# EasyEDA Pro project ProProject_基于STM32的Buck-Boost型数字电源_2024-06-04.epro, board PCB2
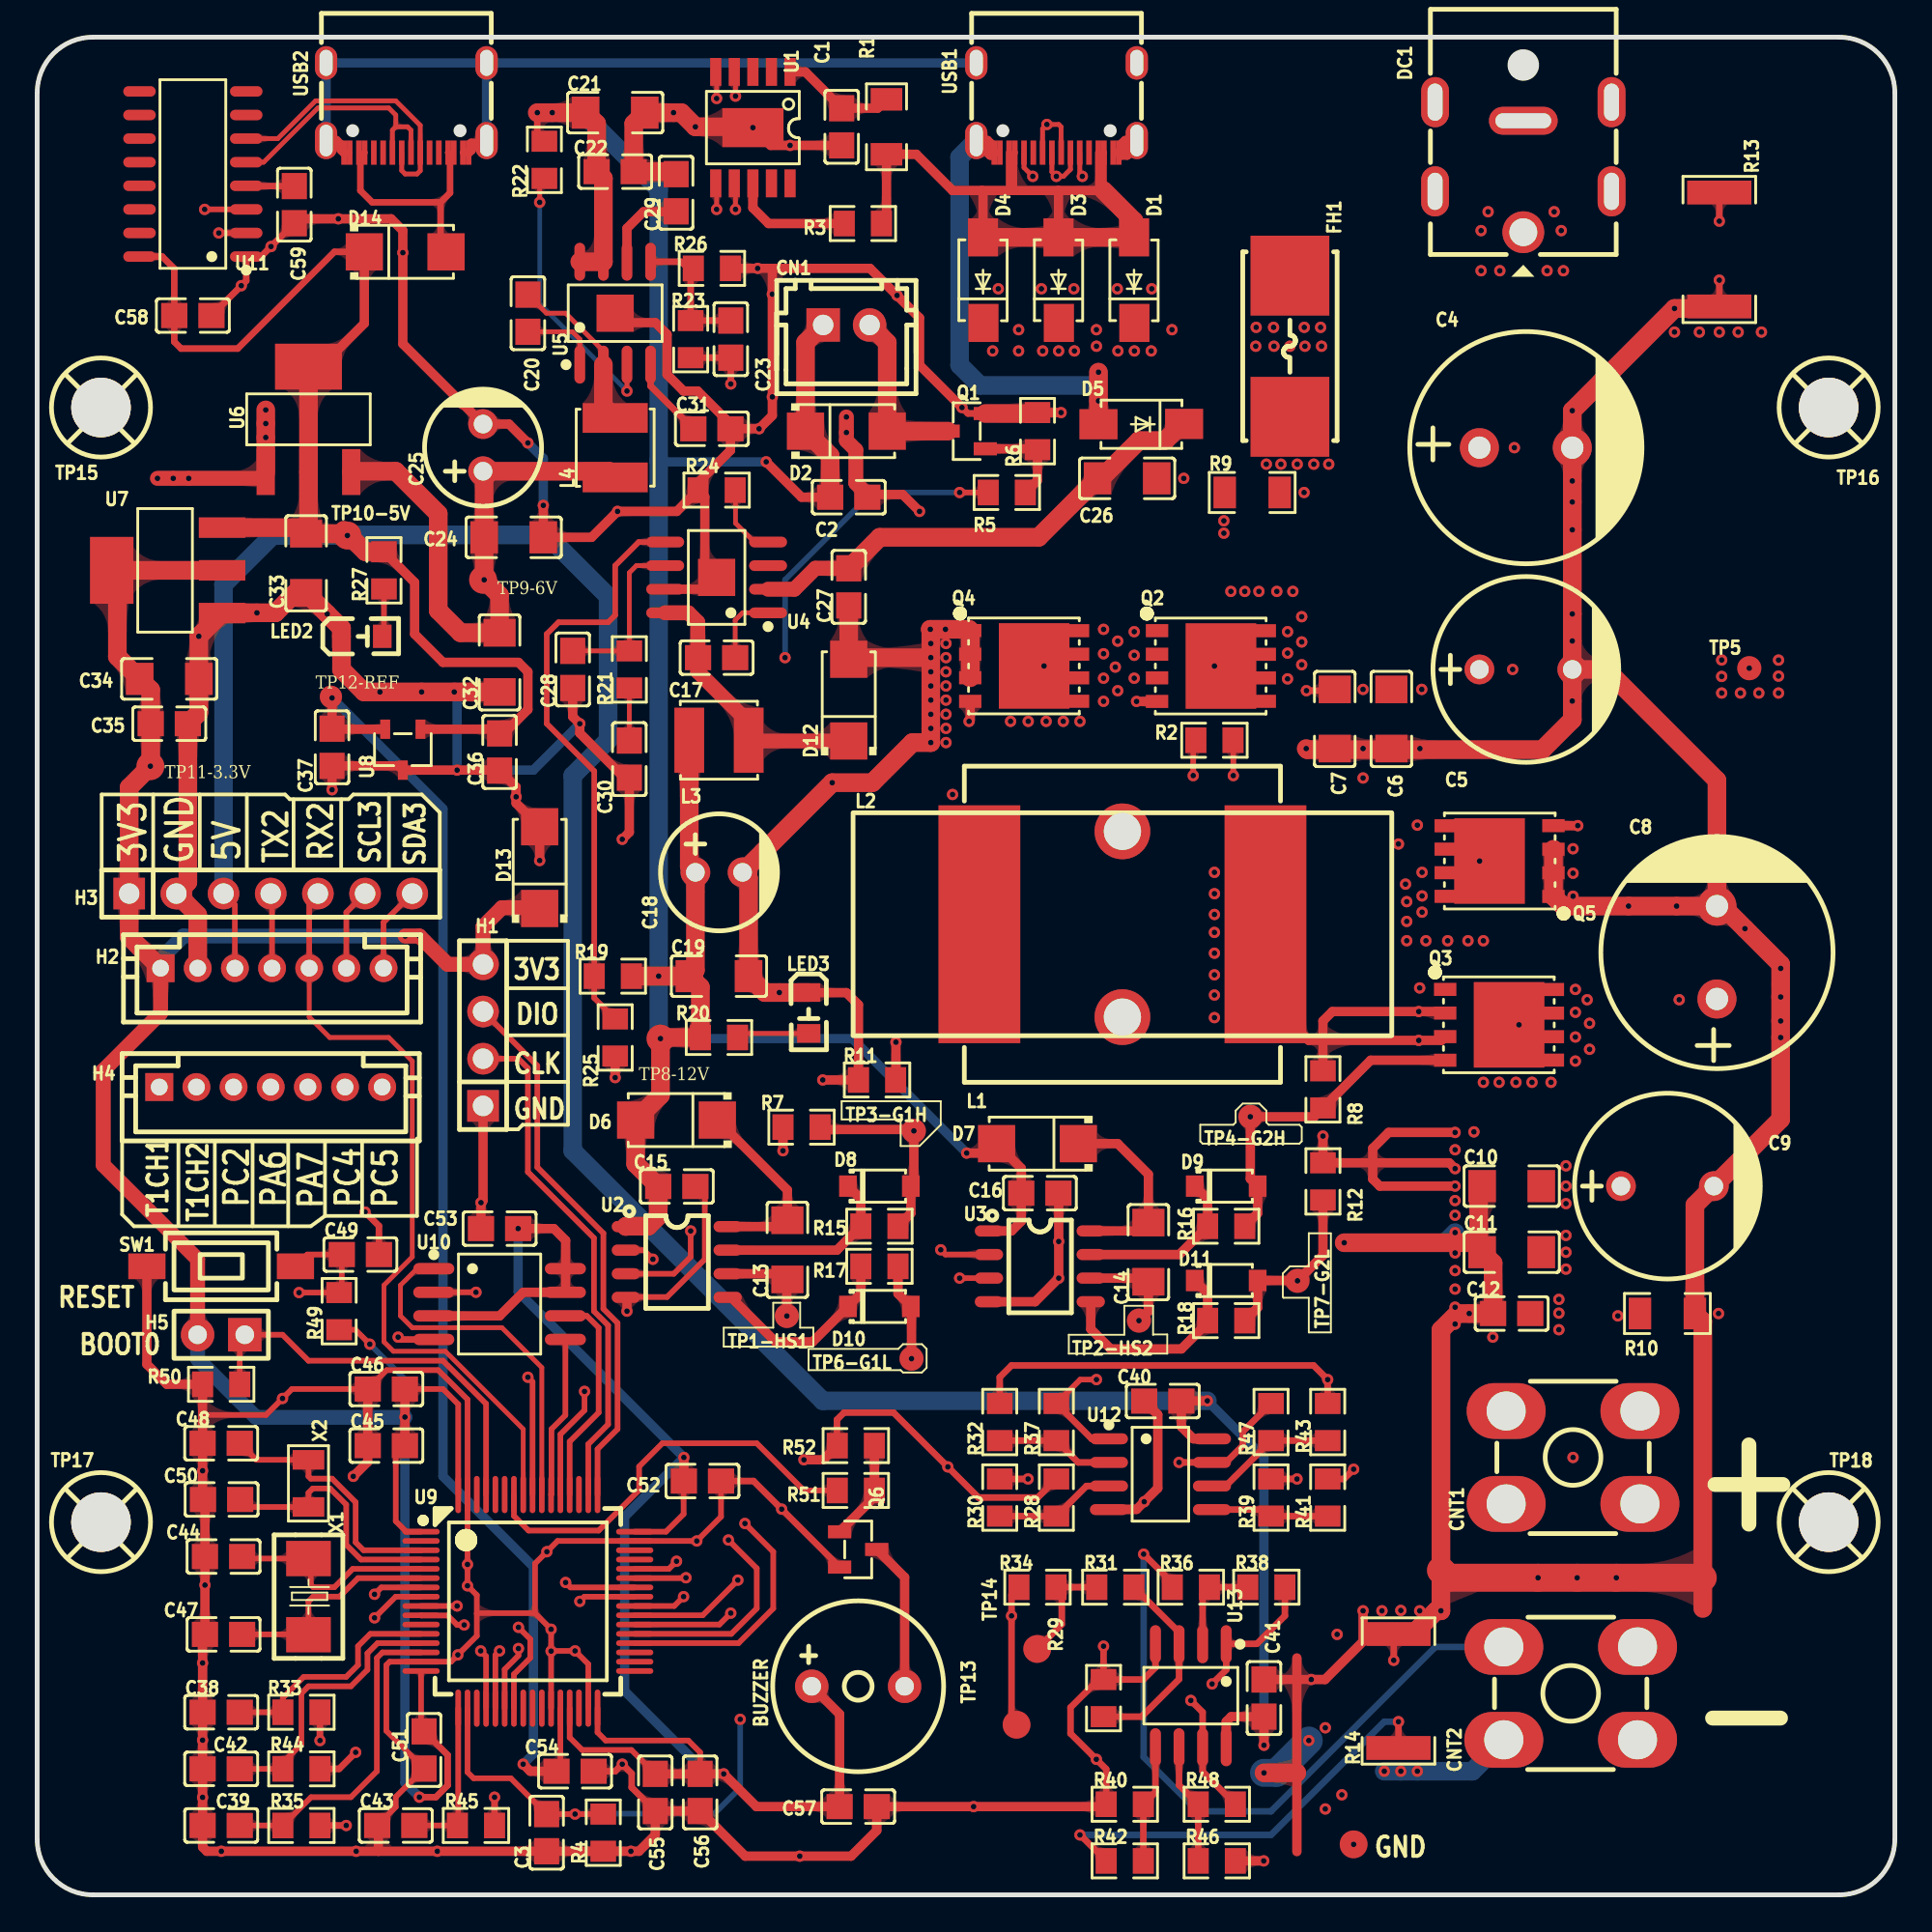
[diagram p9: board, top side]
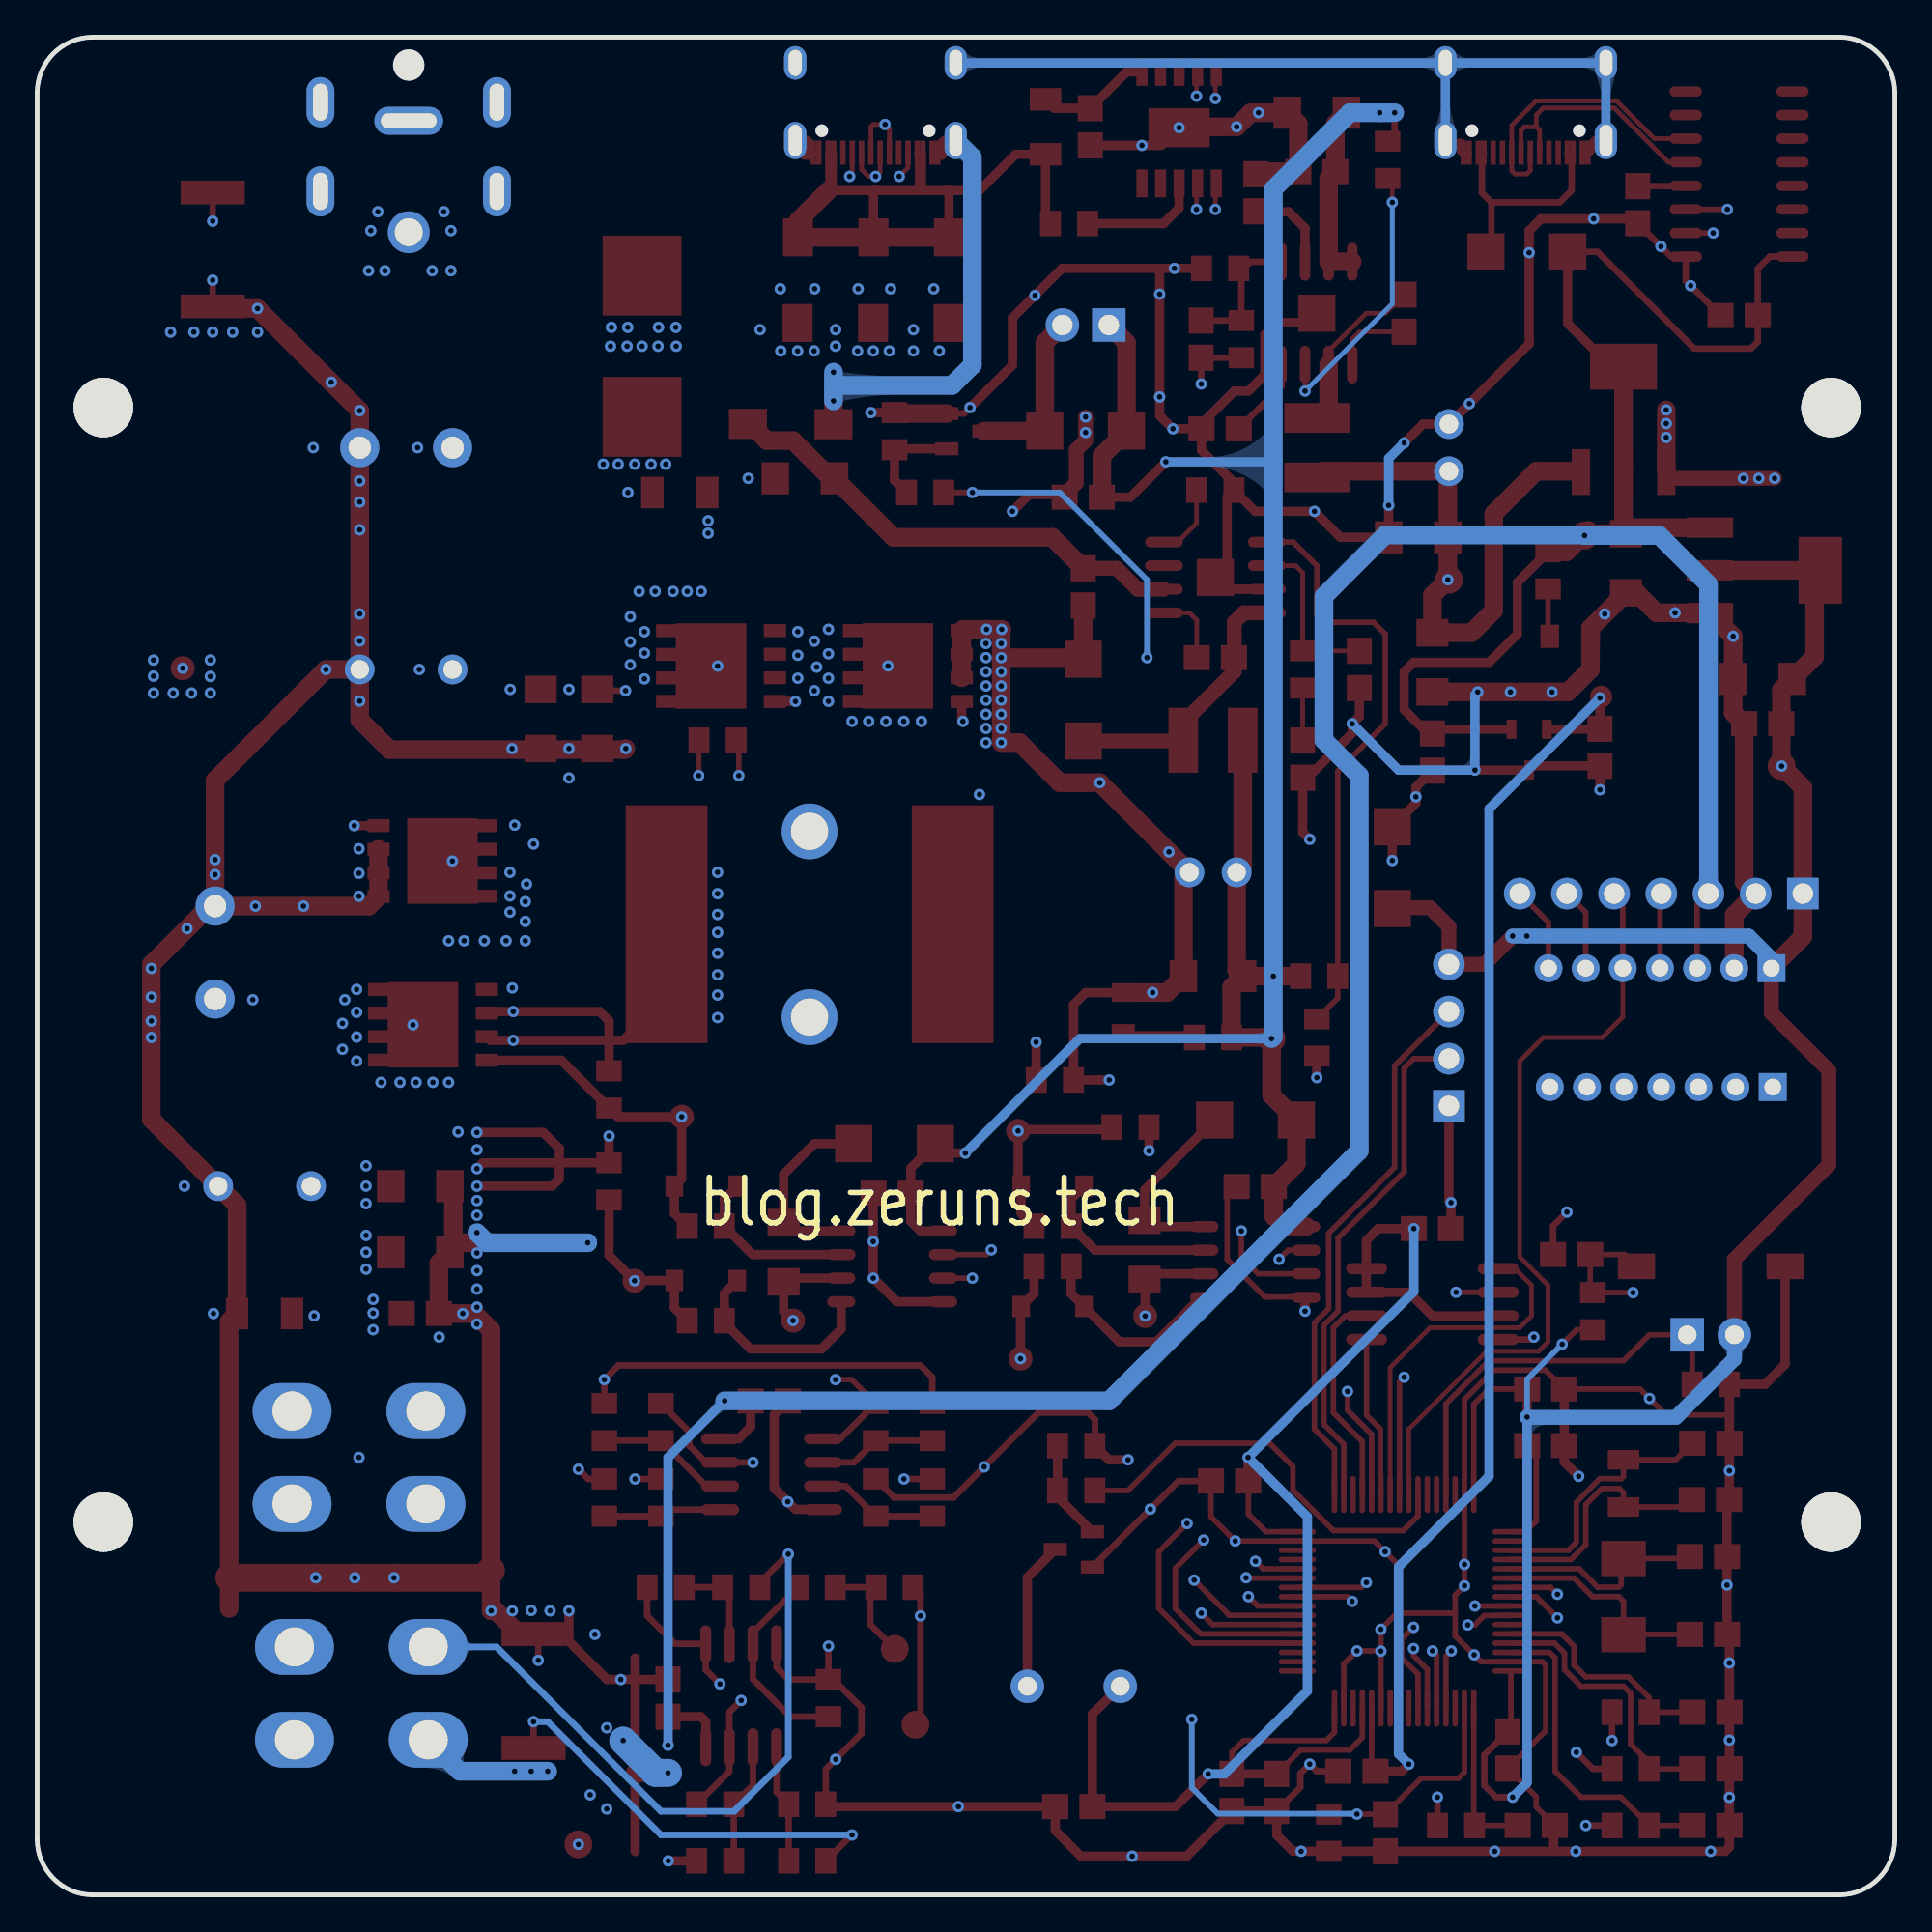
[diagram p10: board, bottom side, seen from below]

Outline 100 x 100 mm; copper layers: Top Layer, GND层, Inner2, Bottom Layer. Coordinates in mm from the lower left corner of the outline.
Outline path: 0,97 0,3 arc(0.88,0.88) 3,0 97,0 arc(99.12,0.88) 100,3 100,97 arc(99.12,99.12) 97,100 3,100 arc(0.88,99.12) 0,97
Stack: Top Layer 0.035mm 外层铜厚1oz / Dielectric1 0.2104mm 7628 RC49% 8.6mil / GND层 0.0152mm 内层铜厚 / Dielectric2 1.065mm 1.1mm H/HOZ 含铜 / Inner2 0.0152mm 内层铜厚 / Dielectric3 0.2104mm 7628 RC49% 8.6mil / Bottom Layer 0.035mm 外层铜厚1oz

## Design rules (mm)
template: 自定义配置
spacing copperThickness1oz (default): track to track 0.102, other pairs 0.152 to 0.3
spacing copperThickness2oz: track to track 0.203, other pairs 0.152 to 0.3
track width copperThickness1oz (default): min 0.127, default 0.254, max 2.54
track width copperThickness2oz: min 0.203, default 0.254, max 2.54
differential pair differentialPair (default): width min 0.127, default 0.254, max 2.54; gap min 0.152, default 0.152
via viaSize (default): diameter min 0.5, default 0.61, max 10; hole min 0.3, default 0.305, max 6.3
net VIN- uses 直连
net VBUS uses 直连
net $1N2183 uses 直连
net GND uses innerPlane1, 直连
net VIN+ uses 直连
net HS-1 uses 直连
net HS-2 uses 直连
net VOUT+ uses 直连
net VOUT- uses 直连
pour e2531 uses copperRegion
pour e2479 uses copperRegion
pour e2565 uses copperRegion
pour e2384 uses copperRegion
pour e2269 uses copperRegion
pour e2353 uses copperRegion
pour e2671 uses copperRegion
pour e2172 uses copperRegion

## Placement (name value [footprint] x y rotation side)
BUZZER  2.9kHz  [BUZ-TH_BD9.0-P5.00-D0.6-FD]  44.2 11.23 0 top
C1  1μF  [C0805]  43.31 95.17 90 top
C2  1μF  [C0805]  43.69 75.23 180 top
C3  100nF  [C0805]  27.43 3.35 90 top
C4  470uF  [CAP-TH_BD12.5-P5.00-D0.6-FD]  80.14 77.9 0 top
C5  220uF  [CAP-TH_BD10.0-P5.00-D0.6-FD-A]  80.14 65.96 0 top
C6  10uF  [C1206]  72.9 63.3 90 top
C7  10uF  [C1206]  69.85 63.3 90 top
C8  470uF  [CAP-TH_BD12.5-P5.00-D0.6-FD]  90.42 50.72 90 top
C9  220uF  [CAP-TH_BD10.0-P5.00-D0.6-FD-A]  87.76 38.15 0 top
C10  10uF  [C1206]  79.38 38.15 0 top
C11  10uF  [C1206]  79.38 34.59 0 top
C12  470nF  [C0805]  79.38 31.29 0 top
C13  1uF  [C1206]  40.39 34.72 90 top
C14  1uF  [C1206]  59.82 34.59 90 top
C15  470nF  [C0805]  34.43 38.13 180 top
C16  470nF  [C0805]  53.97 37.77 180 top
C17  100nF  [C0805]  36.58 66.6 180 top
C18  330uF  [CAP-TH_BD6.3-P2.50-D1.0-FD]  36.7 55.04 0 top
C19  10uF  [C1206]  36.7 49.45 180 top
C20  100nF  [C0805]  26.42 85.14 90 top
C21  10uF  [C1206]  31.12 95.94 180 top
C22  1uF  [C0805]  31.12 92.76 180 top
C23  100pF  [C0805]  37.34 83.74 270 top
C24  10uF  [C1206]  25.65 73.08 180 top
C25  330uF  [CAP-TH_BD6.3-P2.50-D1.0-FD]  24 77.9 90 top
C26  10uF  [C1206]  58.67 76.25 180 top
C27  470nF  [C0805]  43.69 70.41 90 top
C28  39pF  [C0805]  28.83 65.96 270 top
C29  1uF  [C0805]  34.4 91.62 270 top
C30  6.8nF  [C0805]  31.88 61.14 270 top
C31  1uF  [C0805]  36.32 78.92 180 top
C32  10uF  [C1206]  24.89 66.34 90 top
C33  10uF  [C1206]  14.48 71.68 90 top
C34  10uF  [C1206]  7.11 65.46 180 top
C35  470nF  [C0805]  7.11 63.04 180 top
C36  470nF  [C0805]  24.89 61.52 90 top
C37  470nF  [C0805]  15.88 61.77 90 top
C38  330pF  [C0805]  9.91 9.83 0 top
C39  330pF  [C0805]  9.91 3.73 0 top
C40  470nF  [C0805]  60.59 26.58 180 top
C41  470nF  [C0805]  66.04 10.59 90 top
C42  330pF  [C0805]  9.91 6.78 0 top
C43  330pF  [C0805]  19.3 3.73 0 top
C44  20pF  [C0805]  10.03 18.21 0 top
C45  100nF  [C0805]  18.8 24.18 0 top
C46  470nF  [C0805]  18.8 27.23 180 top
C47  20pF  [C0805]  10.03 14.02 0 top
C48  12pF  [C0805]  9.91 24.31 0 top
C49  100nF  [C0805]  17.4 34.47 180 top
C50  12pF  [C0805]  9.93 21.28 0 top
C51  470nF  [C0805]  20.83 7.8 270 top
C52  470nF  [C0805]  35.81 22.28 0 top
C53  470nF  [C0805]  24.89 35.86 0 top
C54  470nF  [C0805]  28.96 6.66 180 top
C55  1uF  [C0805]  33.27 5.51 90 top
C56  470nF  [C0805]  35.69 5.51 90 top
C57  470nF  [C0805]  44.2 4.75 0 top
C58  470nF  [C0805]  8.38 85.01 180 top
C59  100nF  [C0805]  13.84 90.98 90 top
CN1  ZX-XH2.54-2PZZ  [CONN-TH_2P-P2.50_HX25003-2A]  43.56 84.51 0 top
CNT1  T34001  [CONN-TH_T34001]  82.68 23.55 90 top
CNT2  T34001  [CONN-TH_T34001]  82.55 10.85 90 top
D1  SS56  [SMA_L4.3-W2.6-LS5.0-FD]  59.06 86.92 270 top
D2  SS310  [SMA_L4.3-W2.6-LS5.2-RD]  43.56 78.79 0 top
D3  SS56  [SMA_L4.3-W2.6-LS5.0-FD]  54.99 86.92 270 top
D4  SS56  [SMA_L4.3-W2.6-LS5.0-FD]  50.93 86.92 270 top
D5  SS56  [SMA_L4.3-W2.6-LS5.0-FD]  59.44 79.17 0 top
D6  SS310  [SMA_L4.3-W2.6-LS5.2-RD]  34.42 41.71 180 top
D7  SS310  [SMA_L4.3-W2.6-LS5.2-RD]  53.85 40.44 180 top
D8  1N4148W  [SOD-123_L2.8-W1.8-LS3.7-RD]  45.34 38.15 0 top
D9  1N4148W  [SOD-123_L2.8-W1.8-LS3.7-RD]  64.01 38.15 0 top
D10  1N4148W  [SOD-123_L2.8-W1.8-LS3.7-RD]  45.34 31.67 0 top
D11  1N4148W  [SOD-123_L2.8-W1.8-LS3.7-RD]  64.01 33.07 0 top
D12  SS310  [SMA_L4.3-W2.6-LS5.2-RD]  43.69 64.31 90 top
D13  SS310  [SMA_L4.3-W2.6-LS5.2-RD]  27.05 55.3 90 top
D14  SS310  [SMA_L4.3-W2.6-LS5.2-RD]  19.81 88.44 0 top
DC1  HC-DC-007B-2.0  [DC-IN-TH_HC-DC-007B-2.0]  80 93 0 top
FH1  01550900M  [FUSE-SMD_L9.8-W5.0]  67.44 83.36 270 top
H1  -  [HDR-TH_4P-P2.54-V-M]  24 46.28 90 top
H2  BX-PH2.0-7PZZ  [CONN-TH_7P-P2.00_BX-PH2.0-7PZZ]  12.64 49.88 0 top
H3  -  [HDR-TH_7P-P2.54-V-M]  12.57 53.9 0 top
H4  BX-PH2.0-7PZZ  [CONN-TH_7P-P2.00_BX-PH2.0-7PZZ]  12.57 43.48 0 top
H5  -  [HDR-TH_2P-P2.54-V-M-1]  9.91 30.15 180 top
L1  22uH  [IND-SMD_L17.0-W17.0_YSPIA1770-100M]  58.42 52.25 0 top
L2  22uH  [ind-th_l29.0-w12.0-p10.00]  58.42 52.25 270 top
L3  10uH  [IND-SMD_L4.0-W4.0]  36.7 62.15 180 top
L4  10uH  [IND-SMD_L4.0-W4.0]  31.12 77.9 270 top
LED2  NCD0805R1  [LED_0805]  17.53 67.74 0 top
LED3  -  [LED_0805]  41.53 47.42 270 top
NOREF  -  [Pad_e29531]  70.87 2.72 0 top
Q1  -  [SOT-23-3_L2.9-W1.3-P1.90-LS2.4-BR]  50.04 78.79 0 top
Q2  CJAC80SN10  [PDFN-8_L5.8-W5.0-P1.27-LS6.0-BL]  63.18 66.15 270 top
Q3  CJAC80SN10  [PDFN-8_L5.8-W5.0-P1.27-LS6.0-BL]  78.69 46.83 270 top
Q4  CJAC80SN10  [PDFN-8_L5.8-W5.0-P1.27-LS6.0-BL]  53.13 66.15 270 top
Q5  CJAC80SN10  [PDFN-8_L5.8-W5.0-P1.27-LS6.0-BL]  78.72 55.65 90 top
Q6  -  [SOT-23-3_L2.9-W1.3-P1.90-LS2.4-BR]  44.2 18.59 180 top
R1  1K  [R1206]  45.72 95.17 270 top
R2  SDNT2012X103F3950FTF  [R0805]  63.37 62.15 0 top
R3  10K  [R0805]  44.45 89.97 0 top
R4  10kΩ  [R0805]  30.47 3.35 90 top
R5  10Ω  [R0805]  52.2 75.49 180 top
R6  10kΩ  [R0805]  53.85 78.79 270 top
R7  10kΩ  [R0805]  41.15 41.33 0 top
R8  10kΩ  [R0805]  69.22 43.36 270 top
R9  10kΩ  [R1206]  65.41 75.49 0 top
R10  10kΩ  [R1206]  87.76 31.29 180 top
R11  10kΩ  [R0805]  45.21 43.87 0 top
R12  10kΩ  [R0805]  69.22 38.41 270 top
R13  5mΩ  [R2512]  90.55 88.57 270 top
R14  5mΩ  [R2512]  73.28 10.97 270 top
R15  10Ω  [R0805]  45.34 35.99 180 top
R16  10Ω  [R0805]  64.01 35.99 180 top
R17  10Ω  [R0805]  45.34 33.83 180 top
R18  10Ω  [R0805]  64.01 30.91 180 top
R19  68K  [R0805]  30.99 49.45 0 top
R20  4.7K  [R0805]  36.7 46.15 180 top
R21  10K  [R0805]  31.88 65.96 90 top
R22  10kΩ  [R0805]  27.31 93.4 270 top
R23  9.1K  [R0805]  35.18 83.74 270 top
R24  110K  [R0805]  36.58 75.62 0 top
R25  4.7K  [R0805]  31.12 46.15 90 top
R26  1kΩ  [R0805]  36.32 87.55 180 top
R27  1kΩ  [R0805]  18.67 71.3 270 top
R28  4.7kΩ  [R0805]  54.86 21.39 90 top
R29  4.7kΩ  [R0805]  57.4 10.59 90 top
R30  75kΩ  [R0805]  51.82 21.39 270 top
R31  75kΩ  [R0805]  58.04 16.56 0 top
R32  75kΩ  [R0805]  51.82 25.45 270 top
R33  100Ω  [R0805]  14.22 9.83 0 top
R34  5Ω  [R0805]  53.85 16.56 0 top
R35  100Ω  [R0805]  14.22 3.73 0 top
R36  75kΩ  [R0805]  62.1 16.56 0 top
R37  4.7kΩ  [R0805]  54.86 25.45 270 top
R38  4.7kΩ  [R0805]  66.17 16.56 180 top
R39  6.2kΩ  [R0805]  66.42 21.39 90 top
R40  6.2kΩ  [R0805]  58.55 4.88 180 top
R41  100Ω  [R0805]  69.47 21.39 270 top
R42  100Ω  [R0805]  58.55 1.83 0 top
R43  100Ω  [R0805]  69.47 25.45 270 top
R44  100Ω  [R0805]  14.22 6.78 0 top
R45  100Ω  [R0805]  23.62 3.73 0 top
R46  100Ω  [R0805]  63.5 1.83 180 top
R47  6.2kΩ  [R0805]  66.42 25.45 270 top
R48  6.2kΩ  [R0805]  63.5 4.88 180 top
R49  10kΩ  [R0805]  16.26 31.42 270 top
R50  10kΩ  [R0805]  9.91 27.48 0 top
R51  10Ω  [R0805]  44.07 21.77 180 top
R52  10kΩ  [R0805]  44.07 24.18 0 top
SW1  TSA363G25-250B  [SW-SMD_L6.1-W3.6-LS8.0]  9.91 33.83 0 top
TP1-HS1  -  [test-point-0.5mm]  40.36 31.16 0 top
TP2-HS2  -  [test-point-0.5mm]  59.31 30.91 0 top
TP3-G1H  -  [test-point-0.5mm]  47.19 41.12 0 top
TP4-G2H  -  [test-point-0.5mm]  65.31 41.89 0 top
TP5  -  [test-point-0.5mm]  92.16 66.03 0 top
TP6-G1L  -  [test-point-0.5mm]  47.07 28.86 0 top
TP7-G2L  -  [test-point-0.5mm]  67.84 33.05 0 top
TP8-12V  -  [test-point-0.5mm#2]  33.55 46.09 0 top
TP9-6V  -  [test-point-0.5mm#2]  24 70.79 0 top
TP10-5V  -  [test-point-0.5mm#2]  16.7 73.17 0 top
TP11-3.3V  -  [test-point-0.5mm#2]  6.1 60.76 0 top
TP12-REF  -  [test-point-0.5mm#3]  15.81 64.49 0 top
TP13  -  [test-point-0.5mm#2]  52.72 9.16 0 top
TP14  -  [test-point-0.5mm#2]  53.83 13.24 0 top
TP15  -  [M3螺丝]  3.5 80 0 top
TP16  -  [M3螺丝]  96.5 80 0 top
TP17  -  [M3螺丝]  3.5 20 0 top
TP18  -  [M3螺丝]  96.5 20 0 top
U1  CH224K  [ESSOP-10_L4.9-W3.9-P1.0-LS6.0-TL-EP]  38.53 95.13 180 top
U2  EG3112  [SOP-8_L5.0-W3.9-P1.27-LS6.0-BL]  34.43 34.07 270 top
U3  EG3112  [SOP-8_L5.0-W3.9-P1.27-LS6.0-BL]  53.97 33.83 270 top
U4  TPS54360BDDAR  [SOIC-8_L5.0-W4.0-P1.27-LS6.0-BL-EP2.0]  36.58 70.92 90 top
U5  SY8205FCC  [SOIC-8_L5.0-W4.0-P1.27-LS6.0-BL-EP2.0]  31.12 85.14 0 top
U6  AMS1117-5.0  [SOT-223-4_L6.5-W3.5-P2.30-LS7.0-BR]  14.61 79.43 270 top
U7  AMS1117-3.3  [SOT-223-3_L6.5-W3.5-P3.05-LS7.0]  6.98 71.3 0 top
U8  REF3033AIDBZR  [SOT-23-3_L3.0-W1.7-P0.95-LS2.9-BR]  19.69 61.65 90 top
U9  STM32G474RET6  [LQFP-64_L10.0-W10.0-P0.50-LS12.0-BL]  26.42 15.8 270 top
U10  W25Q64JVSSIQ  [SOP-8_L5.3-W5.3-P1.27-LS8.0-BL]  24.89 31.8 270 top
U11  CH340C  [SOP-16_L10.0-W3.9-P1.27-LS6.0-BL]  8.38 92.63 90 top
U12  GS8558-SR  [SOIC-8_L4.9-W3.8-P1.27-LS6.0-BL]  60.47 22.64 270 top
U13  GS8558-SR  [SOIC-8_L4.9-W3.8-P1.27-LS6.0-BL]  62.1 10.72 180 top
USB1  -  [USB_TYPE-C-16P]  55 96.2 180 top
USB2  -  [USB_TYPE-C-16P]  20 96.2 180 top
X1  25MHz  [OSC-SMD_L5.0-W3.2]  14.61 16.05 90 top
X2  32.768kHz  [CRYSTAL-SMD_L3.2-W1.5-2]  14.61 22.15 90 top

## Footprints (pads in the part's own frame, mm; a bottom-side part is the same pattern mirrored in y, then rotated)
BUZ-TH_BD9.0-P5.00-D0.6-FD
  round 1.8 hole 1: 1(-2.5,0) 2(2.5,0)
C0805
  rect 1.41x1.35 smd: 1(-1,0) 2(1,0)
C1206
  rect 1.485x1.728 smd: 1(-1.593,0) 2(1.593,0)
CAP-TH_BD6.3-P2.50-D1.0-FD
  round 1.6 hole 1: 1(-1.27,0) 2(1.27,0)
CAP-TH_BD10.0-P5.00-D0.6-FD-A
  round 1.6 hole 1: 1(-2.5,0) 2(2.5,0)
CAP-TH_BD12.5-P5.00-D0.6-FD
  round 2.1 hole 1.2: 1(-2.5,0) 2(2.5,0)
CONN-TH_2P-P2.50_HX25003-2A
  rect 1.8x1.8 hole 1.1: 1(-1.25,0)
  round 1.8 hole 1.1: 2(1.25,0)
CONN-TH_7P-P2.00_BX-PH2.0-7PZZ
  rect 1.5x1.5 hole 0.9: 1(-6,0)
  round 1.5 hole 0.9: 2(-4,0) 3(-2,0) 4(0,0) 5(2,0) 6(4,0) 7(6,0)
CONN-TH_T34001
  oval 3x4.25 hole 2.1: 1(-2.5,-3.6) 2(2.5,-3.6) 3(2.5,3.6) 4(-2.5,3.6)
CRYSTAL-SMD_L3.2-W1.5-2
  rect 1.05x1.7 smd: 1(-1.27,0) 2(1.27,0)
DC-IN-TH_HC-DC-007B-2.0
  round 2.25 hole 1.5: 1(0,-3.5)
  oval 3.7x1.5 hole 2.999x0.8: 2(0,2.5)
  oval 1.5x2.7 hole 0.8x2: 3(-4.75,3.5) 3(-4.75,-1.3) 3(4.75,3.5) 3(4.75,-1.3)
ESSOP-10_L4.9-W3.9-P1.0-LS6.0-TL-EP
  rect 0.6x1.5 smd: 1(-2,-3) 2(-1,-3) 3(0,-3) 4(1,-3) 5(2,-3) 6(2,3) 7(1,3) 8(0,3) 9(-1,3) 10(-2,3)
  rect 3.3x2.1 smd: 11(0,0)
FUSE-SMD_L9.8-W5.0
  rect 4.3x4.24 smd: 1(-3.8,0) 2(3.8,0)
HDR-TH_2P-P2.54-V-M-1
  rect 1.8x1.8 hole 1: 1(-1.27,0)
  round 1.8 hole 1: 2(1.27,0)
HDR-TH_4P-P2.54-V-M
  rect 1.7x1.7 hole 1.1: 1(-3.81,0)
  round 1.7 hole 1.1: 2(-1.27,0) 3(1.27,0) 4(3.81,0)
HDR-TH_7P-P2.54-V-M
  rect 1.7x1.7 hole 1.1: 1(-7.62,0)
  round 1.7 hole 1.1: 2(-5.08,0) 3(-2.54,0) 4(0,0) 5(2.54,0) 6(5.08,0) 7(7.62,0)
IND-SMD_L4.0-W4.0
  rect 1.6x3.5 smd: 1(-1.6,0) 2(1.6,0)
IND-SMD_L17.0-W17.0_YSPIA1770-100M
  rect 4.4x12.8 smd: 1(-7.7,0) 2(7.7,0)
ind-th_l29.0-w12.0-p10.00
  round 3 hole 2: 1(-5,0) 2(5,0)
LED_0805
  rect 1x1.25 smd: 1(-1.15,0.005) 2(1.05,0.005)
LQFP-64_L10.0-W10.0-P0.50-LS12.0-BL
  oval 0.3x2 smd: 1(-3.75,-5.75) 2(-3.25,-5.75) 3(-2.75,-5.75) 4(-2.25,-5.75) 5(-1.75,-5.75) 6(-1.25,-5.75) 7(-0.75,-5.75) 8(-0.25,-5.75) 9(0.25,-5.75) 10(0.75,-5.75) 11(1.25,-5.75) 12(1.75,-5.75) 13(2.25,-5.75) 14(2.75,-5.75) 15(3.25,-5.75) 16(3.75,-5.75) 33(3.75,5.75) 34(3.25,5.75) 35(2.75,5.75) 36(2.25,5.75) 37(1.75,5.75) 38(1.25,5.75) 39(0.75,5.75) 40(0.25,5.75) 41(-0.25,5.75) 42(-0.75,5.75) 43(-1.25,5.75) 44(-1.75,5.75) 45(-2.25,5.75) 46(-2.75,5.75) 47(-3.25,5.75) 48(-3.75,5.75)
  oval 2x0.3 smd: 17(5.75,-3.75) 18(5.75,-3.25) 19(5.75,-2.75) 20(5.75,-2.25) 21(5.75,-1.75) 22(5.75,-1.25) 23(5.75,-0.75) 24(5.75,-0.25) 25(5.75,0.25) 26(5.75,0.75) 27(5.75,1.25) 28(5.75,1.75) 29(5.75,2.25) 30(5.75,2.75) 31(5.75,3.25) 32(5.75,3.75) 49(-5.75,3.75) 50(-5.75,3.25) 51(-5.75,2.75) 52(-5.75,2.25) 53(-5.75,1.75) 54(-5.75,1.25) 55(-5.75,0.75) 56(-5.75,0.25) 57(-5.75,-0.25) 58(-5.75,-0.75) 59(-5.75,-1.25) 60(-5.75,-1.75) 61(-5.75,-2.25) 62(-5.75,-2.75) 63(-5.75,-3.25) 64(-5.75,-3.75)
M3螺丝
  round 3.2 hole 3.2: 1(-0.064,0.064)
OSC-SMD_L5.0-W3.2
  rect 1.9x2.4 smd: 1(-2.05,0) 2(2.05,0)
Pad_e29531
  round 1.5 smd: TP1(0,0)
PDFN-8_L5.8-W5.0-P1.27-LS6.0-BL
  rect 0.7x1.2 smd: 1(-1.905,-2.9) 2(-0.635,-2.9) 3(0.635,-2.9) 4(1.905,-2.9) 5(1.9,2.9) 6(0.64,2.9) 7(-0.63,2.9) 8(-1.9,2.9)
  rect 4.6x3.8 smd: 9(0,0.54)
R0805
  rect 1.133x1.377 smd: 1(-1,0) 2(1,0)
R1206
  rect 1.208x1.701 smd: 1(-1.479,0) 2(1.479,0)
R2512
  rect 1.282x3.456 smd: 1(-3.067,0) 2(3.067,0)
SMA_L4.3-W2.6-LS5.0-FD
  rect 2.046x1.62 smd: 1(-2.304,-0.009) 2(2.304,0.009)
SMA_L4.3-W2.6-LS5.2-RD
  rect 2x2 smd: 1(-2.2,0) 2(2.2,0)
SOD-123_L2.8-W1.8-LS3.7-RD
  rect 0.95x1.15 smd: 1(-1.692,0) 2(1.692,0)
SOIC-8_L4.9-W3.8-P1.27-LS6.0-BL
  oval 0.588x2.045 smd: 1(-1.905,-2.772) 2(-0.635,-2.772) 3(0.635,-2.772) 4(1.905,-2.772) 5(1.905,2.772) 6(0.635,2.772) 7(-0.635,2.772) 8(-1.905,2.772)
SOIC-8_L5.0-W4.0-P1.27-LS6.0-BL-EP2.0
  oval 0.574x2.038 smd: 1(-1.905,-2.769) 2(-0.635,-2.769) 3(0.635,-2.769) 4(1.905,-2.769) 5(1.905,2.769) 6(0.635,2.769) 7(-0.635,2.769) 8(-1.905,2.769)
  rect 2x2 smd: 9(0,0)
SOP-8_L5.0-W3.9-P1.27-LS6.0-BL
  oval 0.6x1.52 smd: 1(-1.905,-2.74) 2(-0.635,-2.74) 3(0.635,-2.74) 4(1.905,-2.74) 5(1.905,2.74) 6(0.635,2.74) 7(-0.635,2.74) 8(-1.905,2.74)
SOP-8_L5.3-W5.3-P1.27-LS8.0-BL
  oval 0.609x2.204 smd: 1(-1.905,-3.542) 2(-0.635,-3.542) 3(0.635,-3.542) 4(1.905,-3.542) 5(1.905,3.542) 6(0.635,3.542) 7(-0.635,3.542) 8(-1.905,3.542)
SOP-16_L10.0-W3.9-P1.27-LS6.0-BL
  oval 0.56x1.745 smd: 1(-4.445,-2.873) 2(-3.175,-2.873) 3(-1.905,-2.873) 4(-0.635,-2.873) 5(0.635,-2.873) 6(1.905,-2.873) 7(3.175,-2.873) 8(4.445,-2.873) 9(4.445,2.873) 10(3.175,2.873) 11(1.905,2.873) 12(0.635,2.873) 13(-0.635,2.873) 14(-1.905,2.873) 15(-3.175,2.873) 16(-4.445,2.873)
SOT-23-3_L2.9-W1.3-P1.90-LS2.4-BR
  rect 1.25x0.7 smd: 1(1,-0.95) 2(1,0.95) 3(-1,0)
SOT-23-3_L3.0-W1.7-P0.95-LS2.9-BR
  rect 1.038x0.532 smd: 1(1.101,-0.95) 2(1.101,0.95) 3(-1.101,0)
SOT-223-3_L6.5-W3.5-P3.05-LS7.0
  rect 2.5x1.1 smd: 1(2.97,-2.3) 2(2.97,0) 3(2.97,2.3)
  rect 2.34x3.6 smd: 4(-2.97,0)
SOT-223-4_L6.5-W3.5-P2.30-LS7.0-BR
  rect 2.47x0.98 smd: 1(2.835,-2.3) 2(2.835,0) 3(2.835,2.3)
  rect 2.47x3.6 smd: 4(-2.835,0)
SW-SMD_L6.1-W3.6-LS8.0
  rect 2x1.38 smd: 1(-4,0) 2(4,0)
test-point-0.5mm
  round 1.3 smd: 1(0,0)
test-point-0.5mm#2
  round 1.5 smd: 1(0,0)
test-point-0.5mm#3
  round 1.2 smd: 1(0,0)
USB_TYPE-C-16P
  oval 1.2x2 hole 0.7x1.7: 1(-4.193,1.765) 2(4.447,1.765)
  oval 1.2x1.8 hole 0.7x1.4: 3(-4.193,-2.415) 4(4.447,-2.415)
  rect 0.3x1.3 smd: A1(-3.223,2.415) A4(-2.423,2.415) A5(-1.123,2.415) A6(-0.123,2.415) A7(0.377,2.415) A8(1.377,2.415) A9(2.677,2.415) A12(3.477,2.415) B1(3.177,2.415) B4(2.377,2.415) B5(1.877,2.415) B6(0.877,2.415) B7(-0.623,2.415) B8(-1.623,2.415) B9(-2.123,2.415) B12(-2.923,2.415)

## Nets
As in the schematic, except:
GND: C1.1 C2.1 C3.1 C4.2 C5.2 C6.1 C7.1 C8.2 C9.2 C10.1 C11.1 C12.1 C15.1 C16.1 C18.2 C19.1 C21.1 C22.1 C24.1 C25.2 C26.1 C27.1 C28.2 C29.1 C30.2 C31.1 C32.1 C33.1 C34.1 C35.1 C36.1 C37.1 C38.1 C39.1 C40.2 C41.2 C42.1 C43.1 C44.1 C45.1 C46.2 C47.1 C48.1 C49.1 C50.1 C51.2 C52.2 C53.1 C54.1 C55.1 C56.1 C57.2 C58.1 C59.1 D12.2 D13.2 H1.1 H2.2 H3.2 LED2.1 LED3.1 NOREF.TP1 Q1.2 Q4.1 Q4.2 Q4.3 Q5.1 Q5.2 Q5.3 Q6.2 R4.1 R6.1 R9.1 R10.1 R11.1 R12.1 R13.2 R14.1 R24.1 R25.1 R26.1 R28.2 R29.2 R39.2 R40.2 R41.1 R46.1 R50.1 R52.1 SW1.1 TP5.1 U1.11 U2.4 U3.4 U4.7 U4.9 U5.9 U6.1 U7.1 U8.3 U9.15 U9.27 U9.31 U9.47 U9.63 U10.4 U11.1 U12.4 U13.4
ADC_IIN: C42.2 R44.1 U9.13
ADC_IOUT: C43.2 R45.1 U9.17
ADC_VIN: C38.2 R33.1 U9.12
ADC_VOUT: C39.2 R35.1 U9.14
GATE1-H: D8.2 Q2.4 R7.2 R15.1 TP3-G1H.1
GATE1-L: D10.2 Q4.4 R11.2 R17.1 TP6-G1L.1
GATE2-H: D9.2 Q3.4 R8.2 R16.1 TP4-G2H.1
GATE2-L: D11.2 Q5.4 R12.2 R18.1 TP7-G2L.1

Pads without a net: TP15 1; TP16 1; TP17 1; TP18 1; U1 2 3 9 10; U4 3; U11 7 8 9 10 11 12 13 14 15; USB1 A8 B8; USB2 A5 A8 B5 B8

## Via types
v1: diameter 0.61, hole 0.305, Top Layer to Bottom Layer, 401 vias

## Routing (per net, layer and track width the routed paths; a pad name or vN(x,y) marks a point on that pad's centre or on a via; arc(x,y) is an arc through that point)
GND: length 828.4
  Top Layer w0.3: C15.1 35.94,37.62 35.94,34.21 33.91,32.18 31.71,32.18 U2.4 ; v1(27.67,13.12) v1(27.67,14.29) 26.8,15.16 ; v1(27.67,13.12) U9.27 ; v1(27.67,13.12) 27.68,13.13 v1(28.96,13.13) 29.67,12.42 U9.31 ; 26.8,15.16 26.8,17.83 v1(27.44,18.47) 28.01,19.05 U9.47 v1(35.51,19.05) 36.81,20.35 C52.2 ; 26.8,15.16 23.69,15.16 23.67,15.14 ; 8.91,25.92 8.99,25.83 12.32,25.83 v1(13.21,26.72) 13.72,27.23 C46.2 18.81,28.25 21.59,28.25 23.17,26.67 U9.63 v1(23.17,17.79) v1(23.17,16.64) 23.67,16.13 23.67,15.14 ; 23.67,15.14 23.67,13.94 v1(22.65,12.92) 22.28,12.55 U9.15 18.97,12.55 18.8,12.37 18.8,8.83 C51.2 19.3,5.27 19.3,4.73 C43.1
  Top Layer w0.35: R40.2 57.55,6.77 v1(57.02,7.3) 55.63,8.69 55.63,10.08 57.13,11.59 R29.2 ; R29.2 59.55,11.59 60.2,12.24 U13.4 ; R29.2 v1(57.4,13.39) ; v1(49.78,80.06) 50.1,79.74 Q1.2 ; C49.1 18.4,36.01 v1(17.65,36.75) ; C55.1 32,5.78 32,6.53 v1(31.5,7.04) 31.12,6.66 C54.1 ; v1(19.43,30.02) 19.56,29.9 U10.4 ; R41.1 70.34,22.39 v1(70.87,22.91) ; C59.1 v1(12.59,88.73) 12.05,88.19 U11.1 11.25,86.89 v1(10.99,86.62) C58.1 ; R52.1 43.05,24.2 43.05,25.58 43.43,25.96 46.1,25.96 v1(49.02,23.04) 50.67,21.39 53.86,21.39 R28.2 ; R14.1 73.03,13.79 v1(73.03,12.62) ; Q6.2 v1(40.08,20.76) 38.56,22.28 C52.2 ; R39.2 v1(67.82,22.39) ; v1(90.55,86.92) R13.2
  Top Layer w0.5: 71.89,39.41 71.89,38.53 72.28,38.15 v1(76.33,38.15) ; 71.89,39.41 R12.1 v1(69.22,40.85) ; 71.89,39.41 76.01,39.41 v1(76.33,39.09) ; 71.89,39.41 71.89,40.18 72.75,41.04 v1(76.33,41.04) ; C41.2 67.81,11.59 ; 67.81,11.59 v1(68.58,11.59) 69.33,11.59 71.37,13.64 v1(71.37,15.29) ; 67.81,11.59 67.81,12.75 ; 67.81,11.59 67.81,2.33 ; C43.1 18.37,3.67 18.37,2.35 ; R6.1 v1(55.12,79.79) ; 39.58,87.55 v1(38.78,87.55) R26.1 ; 39.58,87.55 44.83,87.55 v1(46.29,86.1) 47.5,84.89 47.5,82.35 v1(49.78,80.06) ; 39.58,87.55 v1(39.58,86.17) v1(39.58,80.64) 39.58,79.63 v1(38.86,78.92) C31.1 37.32,77.76 35.58,76.01 R24.1 ; v1(26.42,78.16) 25.4,79.17 C25.2 v1(22.9,80.27) 19.69,83.49 v1(19.69,88.4) 19.69,89.59 19.05,90.22 v1(16.21,90.22) 14.08,90.22 C59.1 ; C53.1 v1(23.89,37.26) 24,37.37 H1.1 ; R52.1 42.31,23.42 v1(41.28,23.42) ; C28.2 28.83,63.42 v1(29.21,63.04) 29.21,62.53 31.61,60.14 C30.2 31.88,57.2 v1(31.5,56.82) ; R24.1 35.94,75.25 35.94,71.55 U4.9 35.94,70.28 U4.7 ; R24.1 34.43,74.47 v1(31.24,74.47) 29.84,73.08 C24.1 v1(27.25,74.8) ; C1.1 v1(40.53,94.17) 39.48,94.17 v1(38.53,95.13) ; U2.4 31.75,32.11 v1(31.75,31.42) ; 18.37,2.35 v1(21.54,2.35) C3.1 R4.1 v1(31.96,2.35) 32.39,2.35 33.27,3.23 C55.1 C56.1 38.12,2.08 v1(41.05,2.08) 43.81,2.08 45.2,3.46 C57.2 v1(50.41,4.75) 57.42,4.75 R40.2 ; 18.37,2.35 v1(17.17,2.35) v1(9.91,2.35) 9.13,2.35 8.91,2.57 C39.1 v1(8.91,5.25) C42.1 v1(8.91,8.33) C38.1 v1(8.91,12.48) 8.91,13.89 C47.1 v1(9.03,16.67) C44.1 9.03,21.18 C50.1 8.91,21.3 v1(8.91,22.83) C48.1 R50.1 6.98,27.48 5.91,28.56 SW1.1 ; U5.9 31.62,84.63 33.27,84.63 33.91,84 33.91,81.84 34.8,80.95 35.55,80.95 37.08,79.42 37.08,78.92 ; v1(15.88,59.49) C37.1 19.46,60.77 U8.3 v1(22.6,60.54) 24.87,60.54 C36.1 25.78,59.63 v1(25.78,59.11) 25.78,58.77 D13.2 v1(27.05,55.68) ; C40.2 60.32,25.85 60.32,21.9 v1(59.59,21.16) 59.18,20.75 57.71,20.75 U12.4 ; 44.69,75.38 46.59,75.38 v1(47.5,74.47) ; C46.2 C45.1 17.8,23.31 v1(17.02,22.53) ; v1(42.29,43.87) R11.1 44.21,47.91 43.56,48.56 41.54,48.56 LED3.1 ; R25.1 v1(31.12,43.99) ; 51.24,31.93 53.72,31.93 v1(54.99,33.2) v1(54.99,35.17) 54.99,37.75 C16.1 ; R46.1 v1(66.03,1.83)
  Top Layer w0.8: U6.1 11.97,76.25 v1(8.16,76.25) v1(7.32,76.25) v1(6.48,76.25) ; v1(43.56,79.55) v1(43.56,78.72) 43.56,78.28 44.07,77.78 44.07,76 44.69,75.38 C2.1
  Top Layer w1: C29.1 34.26,92.76 C22.1 32.12,95.34 C21.1 v1(34.25,95.94) 34.67,95.94 v1(35.43,95.17) 38.48,95.17 v1(38.53,95.13) ; 77.6,34.78 77.27,35.1 v1(70.36,35.1) ; 77.6,34.78 77.6,37.97 C10.1 ; 77.6,34.78 77.6,34.72 ; 77.6,34.78 C11.1 78.38,34 C12.1 v1(77.09,31.29) 76.45,31.29 75.56,30.4 v1(75.56,15.29) 75.31,15.29 74.06,14.04 R14.1 ; Q4.3 Q4.2 Q4.1 50.16,68.12 v1(48.9,68.12) v1(48.08,68.12) 48.11,68.1 v1(48.11,67.36) v1(48.11,66.6) ; U6.1 v1(12.31,78.45) v1(12.31,79.2) v1(12.31,79.93) ; v1(48.11,66.6) v1(48.11,65.84) v1(48.11,65.08) v1(48.11,64.31) v1(48.11,63.55) v1(48.11,62.79) v1(48.11,62.03) 47.12,62.03 44.96,59.87 v1(42.8,59.87) v1(39.07,56.14) C18.2 38.3,54.72 C19.1 39.18,48.57 v1(39.95,48.57) LED3.1 ; v1(48.11,66.6) 43.77,66.6 D12.2 C27.1 ; 81.62,56.28 Q5.2 Q5.1 82.14,53.22 v1(85.66,53.22) v1(88.25,53.22) C8.2 ; C8.2 90.72,53.22 v1(91.93,52.01) 93.85,50.09 v1(93.85,48.33) v1(93.85,47.04) v1(93.85,46.15) 93.85,41.75 C9.2 89.24,37.13 R10.1 89.66,30.87 89.66,15.42 ; C8.2 v1(90.42,54.92) v1(90.42,55.72) 90.42,60 v1(84.46,65.96) C5.2 ; 16.38,67.74 16.38,68.18 v1(15.62,68.95) C33.1 13.9,70.09 12.83,69.01 v1(11.83,69.01) 9.97,69.01 U7.1 v1(8.7,67.75) C34.1 8.7,63.64 C35.1 8.11,54.52 H3.2 8.64,52.75 H2.2 ; 16.38,67.74 LED2.1 ; 16.38,67.74 16.38,65.96 17.59,64.75 v1(18.45,64.75) v1(20.7,64.75) v1(22.45,64.75) C32.1 ; R13.2 90.44,85.39 v1(88.14,85.39) v1(84.17,81.43) v1(82.64,79.89) C4.2 v1(82.64,76.11) v1(82.64,74.98) v1(82.64,73.48) v1(82.64,68.95) v1(82.64,67.5) C5.2 ; C5.2 v1(82.64,64.26) 82.64,63.26 81.03,61.65 68.37,61.65 v1(68.31,61.7) ; Q1.2 53.8,79.74 R6.1 ; v1(66.04,6.57) 67.81,6.57
  Top Layer w1.5: 75.56,17.47 75.96,17.07 v1(80.79,17.07) v1(82.9,17.07) v1(85.01,17.07) 89.66,17.07
  Inner2 w0.35: H2.2 8.64,52.75 H3.2 ; v1(90.55,86.92) 88.26,86.92 87,85.65 87,44.5 84.2,41.71 75.69,41.71 70.87,36.88 v1(70.87,22.91) ; v1(73.03,12.62) 71.37,10.97 71.37,5 68.2,1.83 v1(66.03,1.83)
  Bottom Layer w0.5: v1(26.42,78.16) 27.25,77.33 v1(27.25,74.8) ; v1(22.45,64.75) 22.6,64.6 v1(22.6,60.54) 26.71,60.54 v1(29.21,63.04)
  Bottom Layer w1: v1(76.33,35.65) 75.78,35.1 v1(70.36,35.1)
  Bottom Layer w1.5: v1(66.04,6.57) 66.71,6.57 v1(68.45,8.31)
  vias: v1(48.92,67.36) v1(48.92,66.6) v1(48.92,65.84) v1(48.92,65.08) v1(48.92,64.31) v1(48.92,63.55) v1(48.92,62.79) v1(48.92,62.03) v1(61.72,76.25) v1(63.88,73.97) v1(63.88,73.3) v1(69.34,8.99) v1(69.34,4.62) v1(69.98,14.02) v1(70.23,5.38) v1(70.87,2.72) v1(71.37,61.7) v1(71.37,60.12) v1(72.39,15.29) v1(73.41,15.31) v1(74.44,61.7) v1(74.42,15.29) v1(76.33,40.11) v1(76.33,37.37) v1(76.33,36.58) v1(76.33,34.56) v1(76.33,33.6) v1(76.33,32.61) v1(76.33,31.64) v1(76.33,30.72) v1(77.34,41.07) v1(78.36,30.02) v1(82.68,56.31) v1(82.68,54.99) v1(82.68,53.76) v1(85.14,77.9) v1(88.14,84.12) v1(89.48,84.12) v1(90.51,31.29) v1(90.55,84.12) v1(90.68,66.47) v1(90.68,65.59) v1(90.68,64.69) v1(91.57,84.12) v1(91.69,64.69) v1(92.07,38.15) v1(92.16,66.03) v1(92.68,64.69) v1(92.82,84.12) v1(93.74,66.47) v1(93.74,65.6) v1(93.74,64.69) v1(93.85,49.87)
P3V3: length 253.5
  Top Layer w0.3: U9.32 30.17,8.75 30.61,8.31 35.05,8.31 35.69,7.67 C56.2 ; v1(17.91,29.64) 17.13,30.42 R49.2 ; U9.16 20.67,8.96 C51.1 ; U9.1 19.87,19.55 19.3,20.12 19.3,23.69 C45.2 ; C55.2 31.99,7.8 29.34,7.8 28.67,8.47 U9.29 ; C46.1 21.84,27.23 22.67,26.41 U9.64 ; U9.48 33.85,19.55 34.8,20.5 34.8,22.26 C52.1
  Top Layer w0.35: C51.1 22.1,7.53 22.1,5.89 21.46,5.26 v1(20.57,5.26)
  Top Layer w0.5: BUZZER.1 43.2,9.73 C57.1 38.72,4.75 v1(36.96,6.51) C56.2 C55.2 ; C46.1 v1(19.8,25.72) C45.2 ; 28.45,33.72 28.45,35.23 27.81,35.86 v1(25.89,35.86) ; 28.45,33.72 U10.8 ; 28.45,33.72 28.45,32.45 U10.7 26.16,32.44 24.89,31.17 U10.3 ; C52.1 v1(34.81,23.55)
  Top Layer w0.8: v1(19.81,51.61) v1(20.57,51.61) 22.1,50.09 H1.4 24,52.12 25.02,53.14 27.01,53.14 D13.1 ; H5.2 8.64,34.21 3.56,39.29 3.56,44.37 6.64,47.46 H2.1
  Top Layer w1: 4.32,71.04 4.32,66.66 C34.2 6.11,64.86 C35.2 6.11,60.77 v1(6.1,60.76) 4.95,59.61 H3.1 4.95,51.57 H2.1 ; U7.2 U7.4
  Inner2 w0.35: H2.1 4.95,51.57 H3.1
  Inner2 w0.5: H1.4 25.89,48.2 v1(25.89,35.86)
  Bottom Layer w0.3: v1(17.91,29.64) 19.8,27.75 v1(19.8,25.72)
  Bottom Layer w0.5: v1(25.89,35.86) 25.89,32.47 v1(34.81,23.55) 31.62,20.35 31.62,10.97 36.08,6.51 v1(36.96,6.51) ; v1(19.8,25.72) 19.8,6.04 v1(20.57,5.26)
  Bottom Layer w0.8: v1(19.8,25.72) 19.78,25.71 11.78,25.71 8.64,28.85 H5.2 ; H2.1 6.64,50.38 7.87,51.61 v1(19.81,51.61) v1(20.57,51.61)
P5V: length 213.8
  Top Layer w0.3: H2.3 10.64,53.29 H3.3
  Top Layer w0.35: D14.1 16,88.44 10.8,83.24 7.75,83.24 7.38,83.6 C58.2 7.38,87.54 6.73,88.19 U11.16
  Top Layer w0.5: v1(66.04,8.05) C41.1 64.28,9.59 64.01,9.32 U13.8 ; v1(62.99,26.59) 61.61,26.59 61.59,26.58 61.59,25.2 62.24,24.55 U12.8 ; U6.4 15.28,82.26 17.61,84.59 D14.1 ; U8.1 24.66,62.75 C36.2 25.13,62.52 26.42,63.81 26.42,65.84 25.91,66.34 21.84,66.34 20.32,67.87 20.32,70.65 R27.1
  Top Layer w1: U6.4 U6.2 14.61,73.4 C33.2 ; 16.51,73.46 17.67,72.3 R27.1 ; U7.3 14.15,73.6 C33.2 ; v1(16.7,73.17) 16.6,73.27 C33.2
  Inner2 w0.35: H3.3 10.64,53.29 H2.3
  Bottom Layer w0.5: v1(62.99,26.59) 66.04,23.55 v1(66.04,8.05)
  Bottom Layer w1: H3.3 10.03,70.54 12.67,73.17 v1(16.7,73.17) 16.73,73.2 27.43,73.2 30.73,69.9 30.73,62.15 28.83,60.25 28.83,40.06 42.29,26.59 v1(62.99,26.59)
P6V: length 54.3
  Top Layer w0.35: R23.2 C23.2 v1(37.34,81.33)
  Top Layer w1: L4.2 30.78,76.63 C25.1 24.06,76.57 C24.2 v1(24.06,70.79) 24.89,69.96 C32.2 22.79,67.94 21.59,69.14 21.59,74.35 19.3,76.63 16.95,76.63 U6.3
  Inner2 w0.35: v1(37.34,81.33) 37.34,77.78 30.35,70.79 v1(24.06,70.79)
P12V: length 150.2
  Top Layer w0.35: v1(26.92,95.94) 26.92,94.78 R22.1
  Top Layer w0.5: C2.2 41.15,75.23 v1(39.24,77.14) ; 51.24,35.74 52.45,35.74 52.97,36.26 C16.2 52.97,39.11 D7.2 51.14,39.93 v1(50.04,39.93)
  Top Layer w1: L3.2 35.1,55.37 C18.1 35.43,49.78 C19.2 ; R19.2 v1(33.46,49.45) C19.2 ; C19.2 35.7,48.86 R20.2 33.61,46.15 v1(33.55,46.09) 33.55,43.04 D6.2 32.22,39.35 C15.2 33.43,36.53 32.89,35.99 31.71,35.99 U2.1 ; C2.2 42.69,77.46 41.36,78.79 41.36,83.56 CN1.1 ; v1(26.92,95.94) v1(27.73,95.94) C21.2 30.12,95.34 C22.2 30.48,92.4 U5.7 U5.8
  Bottom Layer w0.5: v1(39.24,77.14) 33.52,77.14 33.46,77.2 ; v1(50.04,39.93) 43.87,46.09 v1(33.55,46.09)
  Bottom Layer w1: v1(33.55,46.09) 33.46,46.19 v1(33.46,49.45) 33.46,91.82 29.34,95.94 v1(27.73,95.94) v1(26.92,95.94)
VBUS: length 40.9
  Top Layer w0.35: USB1.B9 57.12,91.75 57.4,91.75 57.4,93.77 USB1.A4 ; 52.58,91.75 52.58,93.74 USB1.B4 ; USB1.A9 52.32,91.75
  Top Layer w0.5: 54.96,91.75 50.85,91.75 ; 54.96,91.75 57.12,91.75 ; 54.96,91.75 54.98,91.72 D3.1 ; R3.2 45.72,90.24 R1.2 47.33,93.69 49.28,91.75 50.85,91.75 ; 50.85,91.75 50.92,91.68 D4.1
  Top Layer w1: D4.1 D3.1 D1.1 59.05,90.1 57.4,91.75
VBUS2: length 12.4
  Top Layer w0.35: 21.72,91.11 18.03,91.11 17.4,91.75 17.4,93.56 USB2.B4 ; 21.72,91.11 21.72,88.74 D14.2 ; 21.72,91.11 22.22,91.62 22.22,93.68 USB2.B9
VIN+: length 77.8
  Top Layer w0.35: C7.2 69.78,64.82 v1(68.33,64.82) ; R30.1 v1(53.34,22.39)
  Top Layer w0.8: U4.2 40.76,70.28 41.89,71.41 C27.2
  Top Layer w1: D5.2 61.62,79.18 60.72,78.28 59.31,78.28 57.28,76.25 C26.2 53.91,73.08 45.35,73.08 C27.2
  Inner2 w0.35: v1(53.34,22.39) 66.68,35.72 66.68,63.17 v1(68.33,64.82)
  vias: v1(63.37,66.15) v1(64.26,70.17) v1(65.01,70.17) v1(65.77,70.17) v1(66.17,77.01) v1(66.73,70.17) v1(66.95,77.01) v1(67.31,68) v1(67.31,66.84) v1(67.31,65.46) v1(67.6,70.17) v1(67.83,77.01) v1(68.07,68.8) v1(68.07,67.44) v1(68.07,66.22) v1(68.2,75.49) v1(68.72,77.01) v1(69.53,77.01) v1(71.37,64.89) v1(74.53,64.89) v1(79.43,65.96) v1(79.52,77.9)
VIN-: length 175.8
  Top Layer w0.3: USB2.B1 USB2.A12
  Top Layer w0.35: v1(90.55,90.09) R13.1 ; USB2.A1 USB2.B12 ; R43.1 v1(69.47,27.74) 68.71,28.5 52.45,28.5 51.82,27.86 R32.1
  Top Layer w0.5: USB2.1 24.04,94.28 23.37,94.28 23.37,93.93 USB2.A1 ; USB2.A12 16.38,93.92 16.38,94.16 16.11,94.44 USB2.2 ; USB1.A12 51.39,93.65 51.31,93.65 50.55,94.41 USB1.2 51.16,94.44 51.31,94.28 51.31,94 USB1.A12 ; 58.42,94.28 58.57,94.44 USB1.1 59.19,94.17 58.67,93.65 58.36,93.65 USB1.A1 58.42,93.98 58.42,94.28
  Top Layer w1: v1(57.13,81.97) v1(57.13,80.42) D5.1
  Inner2 w0.35: v1(69.47,27.74) 69.47,36.37 75.44,42.34 83.95,42.34 86.36,44.75 86.36,85.9 v1(90.55,90.09)
  Bottom Layer w0.5: USB2.3 USB2.1 ; USB2.3 USB2.4 USB2.2 ; USB2.3 USB1.4
  Bottom Layer w1: 57.13,81.25 50.75,81.25 49.66,82.35 49.66,93.54 USB1.2 ; 57.13,81.25 v1(57.13,80.42) ; 57.13,81.25 v1(57.13,81.97)
ADC_IIN: length 15
  Top Layer w0.3: C42.2 12.89,6.78 ; 12.89,6.78 R44.1 ; 12.89,6.78 14.22,8.12 14.22,10.85 14.61,11.23 16.89,11.23 17.78,12.12 17.78,13 18.32,13.55 U9.13
ADC_IOUT: length 8.8
  Top Layer w0.3: 22.37,3.73 R45.1 ; 22.37,3.73 22.67,4.03 U9.17 ; 22.37,3.73 C43.2
ADC_TEMP: length 87.7
  Top Layer w0.3: 62.25,62.15 62.25,62.04 62.23,62.03 v1(62.23,60.25) ; U9.18 23.17,6.6 23.5,6.27 25.5,6.27 C3.2 v1(28.95,4.35) R4.2
  Inner2 w0.3: v1(37.85,9.45) 39.62,11.23 39.62,16.56 53.85,30.78 53.85,48.56 62.23,56.95 v1(62.23,60.25)
  Bottom Layer w0.3: v1(28.95,4.35) 28.98,4.37 36.45,4.37 37.85,5.77 v1(37.85,9.45)
ADC_VIN: length 12.6
  Top Layer w0.3: U9.12 17.94,14.05 17.27,13.39 17.27,12.37 16.64,11.74 14.35,11.74 13.22,10.61 R33.1 C38.2
ADC_VOUT: length 17.2
  Top Layer w0.3: C39.2 R35.1 14.75,5.26 16.89,5.26 18.29,6.66 18.29,12.75 18.59,13.05 U9.14
BOOT0: length 22.2
  Top Layer w0.3: U9.61 24.17,26.43 21.84,28.75 14.61,28.75 13.21,30.15 H5.1 10.91,29.88 R50.2
CC1: length 22.2
  Top Layer w0.254: USB1.A5 56.12,92.64 v1(56.26,92.51) ; U1.7 37.59,92.07 v1(37.59,90.73)
  Inner2 w0.254: v1(37.59,90.73) 54.48,90.73 v1(56.26,92.51)
CC2: length 20.6
  Top Layer w0.254: v1(53.59,92.51) 53.12,92.98 USB1.B5 ; v1(36.58,90.73) 36.58,92.08 U1.6
  Inner2 w0.254: v1(36.58,90.73) 38.35,92.51 v1(53.59,92.51)
CH340_RXD: length 95.7
  Top Layer w0.3: U11.3 v1(9.02,90.73) ; v1(34.93,17.07) 34.91,17.05 U9.43
  Inner2 w0.3: v1(9.02,90.73) 9.02,76.5 13.21,72.31 13.21,58.98 15.24,56.95 23.11,56.95 28.07,51.99 28.07,30.4 31.12,27.36 31.12,17.96 32,17.07 v1(34.93,17.07)
CH340_TXD: length 91.7
  Top Layer w0.3: v1(34.42,17.96) 34.01,17.55 U9.44 ; v1(9.78,89.46) U11.2
  Inner2 w0.3: v1(34.42,17.96) 32.13,17.96 31.75,18.34 31.75,27.61 28.7,30.66 28.7,52.25 23.37,57.58 15.49,57.58 13.84,59.23 13.84,72.44 9.65,76.63 9.65,89.33 v1(9.78,89.46)
D+: length 13.6
  Top Layer w0.254: USB2.B6 19.12,94.99 19.3,95.17 ; USB2.A6 20.12,94.99 19.94,95.17 19.3,95.17 ; U11.5 12.19,93.27 15.11,96.19 18.92,96.19 19.3,95.81 19.3,95.17
D-: length 15.3
  Top Layer w0.254: USB2.A7 19.62,92.82 19.81,92.63 20.45,92.63 20.62,92.81 USB2.B7 20.62,95.25 19.3,96.57 14.99,96.57 12.95,94.54 U11.6
DN: length 25.4
  Top Layer w0.254: USB1.B7 55.62,92.89 55.25,92.51 v1(54.86,92.51) 54.62,92.75 USB1.A7 ; U1.5 36.58,98.08 v1(36.58,96.7)
  Inner2 w0.254: v1(54.86,92.51) 54.86,93.78 52.45,96.19 37.08,96.19 v1(36.58,96.7)
DP: length 22.5
  Top Layer w0.254: USB1.B6 54.12,95.07 v1(54.36,95.3) 54.99,95.3 55.12,95.17 55.12,93.79 USB1.A6 ; U1.4 37.59,98.07 v1(37.59,96.83)
  Inner2 w0.254: v1(37.59,96.83) 37.85,96.57 52.71,96.57 53.97,95.3 v1(54.36,95.3)
EN: length 14.9
  Top Layer w0.254: v1(27.05,91.11) 27.05,92.14 R22.2 ; U5.3 v1(31.75,80.95)
  Bottom Layer w0.254: v1(31.75,80.95) 27.05,85.65 v1(27.05,91.11)
FAN_PWM: length 79.2
  Top Layer w0.3: v1(34.8,16.05) 34.29,15.55 U9.40 ; v1(49.66,75.49) R5.2
  Inner2 w0.3: v1(34.8,16.05) 35.81,16.05 39.12,19.35 39.12,51.74 44.96,57.58 44.96,65.33 43.69,66.6 v1(40.26,66.6)
  Bottom Layer w0.3: v1(49.66,75.49) 44.96,75.49 40.26,70.79 v1(40.26,66.6)
GATE1-H: length 39.5
  Top Layer w0.5: Q2.4 v1(59.18,64.24) ; 42.4,41.2 47.12,41.2 v1(47.19,41.12) 47.19,38.31 D8.2 47.03,36.68 R15.1
  Inner2 w0.5: v1(59.18,64.24) 47.62,52.69 47.62,41.55 v1(47.19,41.12)
GATE1-L: length 44.7
  Top Layer w0.5: R11.2 46.23,43.88 v1(46.23,45.9) ; R17.1 46.34,32.37 D10.2 47.07,31.64 v1(47.07,28.86) ; Q4.4 50.23,63.23 v1(50.16,63.17)
  Inner2 w0.5: v1(47.07,28.86) 47.07,39.47 46.23,40.31 v1(46.23,45.9) 46.23,52.76 50.16,56.69 v1(50.16,63.17)
GATE2-H: length 18.1
  Top Layer w0.5: R16.1 65.7,36.68 D9.2 65.31,38.55 v1(65.31,41.89) 68.74,41.89 R8.2 71.78,44.93 Q3.4
GATE2-L: length 46
  Top Layer w0.5: Q5.4 v1(82.93,57.56) ; R12.2 69.22,34.42 v1(67.84,33.05) 67.83,33.07 D11.2 65.7,31.6 R18.1
  Inner2 w0.5: v1(82.93,57.56) 82.83,57.45 75.31,57.45 67.84,49.99 v1(67.84,33.05)
HRTIM1_CHD1: length 35.7
  Top Layer w0.3: U9.36 37.75,13.55 39.62,15.42 39.62,18.47 v1(38.1,19.99) ; v1(35.18,35.74) 35.18,34.34 34.27,33.43 U2.3
  Inner2 w0.3: v1(35.18,35.74) 38.1,32.82 v1(38.1,19.99)
HRTIM1_CHD2: length 29.9
  Top Layer w0.3: U2.2 32.66,34.7 v1(33.15,34.21) ; U9.37 37.37,14.05 38.74,15.42 38.74,17.58 v1(37.21,19.1)
  Inner2 w0.3: v1(33.15,34.21) 37.21,30.15 v1(37.21,19.1)
HRTIM1_CHF1: length 30.1
  Top Layer w0.3: 51.24,33.2 v1(49.66,33.2) ; U9.38 36.72,14.55 v1(37.34,15.16)
  Inner2 w0.3: v1(49.66,33.2) 49.28,32.82 49.28,27.48 37.34,15.54 v1(37.34,15.16)
HRTIM1_CHF2: length 31.3
  Top Layer w0.3: U9.39 35.83,15.05 v1(37.72,16.94) ; 51.24,34.47 48.9,34.47 v1(48.64,34.72)
  Inner2 w0.3: v1(37.72,16.94) 48.64,27.86 v1(48.64,34.72)
HS-1: length 43.2
  Top Layer w0.5: R7.1 v1(40.15,40.06) ; v1(40.36,31.16) 40.36,33.1 C13.1 40.08,33.43 U2.6
  Inner2 w0.5: v1(40.36,31.16) 44.96,35.76 44.96,40.07 ; v1(40.15,40.06) 44.94,40.06 44.96,40.07 ; v1(49.28,59.23) 49.28,57.2 44.96,52.88 44.96,40.07
  vias: v1(52.4,63.17) v1(53.35,63.17) v1(54.2,66.15) v1(54.31,63.17) v1(55.24,63.17) v1(56.13,63.17) v1(57.4,68.12) v1(57.4,66.81) v1(57.4,65.49) v1(57.4,64.25) v1(58.04,66.09) v1(58.17,67.49) v1(58.17,64.82) v1(59.06,68) v1(59.06,66.73) v1(59.06,65.49)
HS-2: length 46.3
  Top Layer w0.5: Q3.2 75.71,47.55 v1(74.37,47.55) 69.72,47.55 69.22,47.04 69.22,46 ; R8.1 69.22,46 ; 69.22,46 v1(74.37,46) 75.59,46 Q3.3 ; 69.22,46 68.45,46 66.12,48.33 L1.2 ; v1(59.31,30.91) 59.82,31.42 C14.1 59.62,33.2 U3.6
  Inner2 w0.5: L2.2 59.31,46.36 v1(59.31,30.91)
  vias: v1(63.37,55.04) v1(63.37,53.89) v1(63.37,52.77) v1(63.37,51.81) v1(63.37,50.69) v1(63.37,49.53) v1(63.37,48.44) v1(63.37,47.22) v1(73.28,56.57) v1(73.66,54.41) v1(73.72,53.46) v1(73.72,52.4) v1(73.72,51.36) v1(74.29,57.58) v1(74.42,48.82) v1(74.55,55.04) v1(74.55,53.77) v1(74.55,52.9) v1(74.76,51.36) v1(75.93,51.36) v1(77.02,51.36) v1(77.65,55.65) v1(77.85,51.36)
I2C3_SCL: length 52.1
  Top Layer w0.3: H2.6 16.64,52.89 H3.6 ; U9.42 28.71,16.55 v1(28.45,16.81)
  Inner2 w0.3: H2.6 16.64,47.41 17.4,46.66 19.18,46.66 20.7,45.14 20.7,34.21 25.78,29.13 26.42,29.13 28.45,27.1 v1(28.45,16.81)
  Inner2 w0.35: H3.6 16.64,52.89 H2.6
I2C3_SDA: length 51.8
  Top Layer w0.3: U9.41 29.46,16.05 v1(29.21,15.8) ; H3.7 18.64,52.35 H2.7
  Inner2 w0.3: H2.7 18.64,47.95 21.21,45.39 21.21,36.37 30.35,27.23 30.35,16.94 v1(29.21,15.8)
  Inner2 w0.35: H2.7 18.64,52.35 H3.7
PA6: length 38.2
  Top Layer w0.3: v1(23.88,13.13) 24.17,12.84 U9.20
  Inner2 w0.3: H4.4 12.57,38.02 23.88,26.72 v1(23.88,13.13)
PA7: length 37.8
  Top Layer w0.3: v1(24.89,13.13) 24.67,12.91 U9.21
  Inner2 w0.3: v1(24.89,13.13) 24.51,13.51 24.51,26.85 14.57,36.79 H4.5
PB3: length 45.6
  Top Layer w0.3: U9.56 26.67,27.61 v1(26.42,27.86) ; H2.4 12.64,53.83 H3.4
  Inner2 w0.3: H2.4 12.64,47.48 14.1,46.03 18.92,46.03 20.07,44.88 20.07,39.55 19.56,39.04 19.56,34.47 26.16,27.86 v1(26.42,27.86)
  Inner2 w0.35: H2.4 12.64,53.83 H3.4
PB4: length 46.3
  Top Layer w0.254: U9.57 26.17,25.07 21.97,29.26 19.18,29.26 18.67,29.77 18.67,32.82 20.19,34.34 20.19,44.88 18.92,46.15 15.75,46.15 14.64,47.26 H2.5
  Top Layer w0.3: H3.5 14.64,53.43 H2.5
  Inner2 w0.35: H3.5 14.64,53.43 H2.5
PB5: length 22.6
  Top Layer w0.3: R51.2 41.28,21.77 38.74,24.31 33.66,24.31 32.4,23.06 32.4,21.79 30.23,19.61 26.46,19.61 25.67,20.4 U9.58
PC0: length 45.3
  Top Layer w0.3: U9.8 19.3,16.05 v1(18.16,14.91)
  Inner2 w0.3: H4.1 7.11,42.95 7.11,15.8 10.8,12.12 16.51,12.12 17.27,12.88 17.27,14.02 v1(18.16,14.91)
PC1: length 57.5
  Top Layer w0.3: U9.9 v1(22.61,15.55)
  Inner2 w0.3: H4.2 8.57,44.94 8.13,45.39 5.97,45.39 5.21,44.63 5.21,41.71 6.6,40.31 6.6,13.39 8.38,11.61 16.76,11.61 20.7,15.55 v1(22.61,15.55)
PC2: length 62.4
  Top Layer w0.3: U9.10 20.68,15.04 22.1,15.04 22.61,14.53 v1(22.99,14.53)
  Inner2 w0.3: H4.3 10.57,45.1 9.78,45.9 5.72,45.9 4.57,44.75 4.57,41.58 6.1,40.06 6.1,13 8,11.1 17.02,11.1 20.45,14.53 v1(22.99,14.53)
PC4: length 37.6
  Top Layer w0.3: U9.22 25.17,12.14 25.91,12.88 v1(25.91,13.26)
  Inner2 w0.3: H4.6 16.57,35.67 25.15,27.1 25.15,14.02 v1(25.91,13.26)
PC5: length 37.1
  Top Layer w0.3: v1(25.91,14.4) 26.54,13.77 26.54,12.75 25.67,11.87 U9.23
  Inner2 w0.3: H4.7 18.57,34.56 25.78,27.36 25.78,14.53 v1(25.91,14.4)
PC10: length 11.7
  Top Layer w0.3: U10.6 29.59,31.17 30.23,30.53 30.23,25.96 28.67,24.4 U9.52
PC11: length 16.4
  Top Layer w0.3: U9.53 28.17,24.79 29.46,26.09 v1(29.46,27.1) ; v1(23.62,32.44) U10.2
  Inner2 w0.3: v1(29.46,27.1) 24.13,32.44 v1(23.62,32.44)
PC12: length 8.7
  Top Layer w0.3: U10.5 28.43,25.82 27.69,25.07 27.69,21.57 U9.54
PD2: length 19.4
  Top Layer w0.254: U9.55 27.17,28.38 25.02,30.53 20.19,30.53 19.56,31.17 19.56,32.82 20.45,33.71 U10.1
REF_3V3: length 133.8
  Top Layer w0.3: 64.25,62.15 64.39,62.01 v1(64.39,60.25) ; U9.28 28.17,6.87 C54.2
  Top Layer w0.5: C54.2 26.54,6.66 v1(26.16,7.04) ; U8.2 15.9,62.75 C37.2 v1(15.88,64.43) TP12-REF.1
  Inner2 w0.5: v1(64.39,60.25) 64.39,67.87 61.85,70.41 40.51,70.41 36.07,65.96 17.41,65.96 v1(15.88,64.43)
  Bottom Layer w0.5: v1(15.88,64.43) 21.84,58.46 21.84,22.53 26.72,17.66 26.72,7.59 v1(26.16,7.04)
RST: length 27.6
  Top Layer w0.3: SW1.2 14.54,34.47 C49.2 16.4,32.56 R49.1 v1(14.1,32.42) ; U9.7 18.53,16.55 v1(18.16,16.18)
  Inner2 w0.3: v1(14.1,32.42) 14.1,26.47 18.16,22.4 v1(18.16,16.18)
SWCLK: length 27.8
  Top Layer w0.3: U9.50 29.67,24.26 30.73,25.32 30.73,30.66 29.97,31.42 29.97,35.36 26.42,38.91 26.42,44.5 25.91,45.01 H1.2
SWDIO: length 29.4
  Top Layer w0.3: H1.3 26.92,44.63 26.92,39.17 30.48,35.61 30.48,31.55 31.24,30.78 31.24,25.07 30.17,23.99 U9.49
VOUT+: length 36.8
  Top Layer w0.35: R34.1 52.45,16.16 v1(52.45,15.02) 52.45,9.43 TP13.1
  Inner2 w0.35: v1(52.45,15.02) 65.51,15.02 71.5,21.01 79.04,21.01 CNT1.4
  vias: v1(77.85,43.74) v1(78.7,43.74) v1(79.6,43.74) v1(79.77,46.83) v1(80.47,43.74) v1(81.49,43.74) v1(81.91,32.06) v1(81.91,31.31) v1(81.91,30.42) v1(82.3,39.24) v1(82.3,38.15) v1(82.3,37.21) v1(82.3,35.5) v1(82.3,34.59) v1(82.3,33.68) v1(82.68,23.55) v1(82.8,48.74) v1(82.8,47.51) v1(82.8,46.18) v1(82.8,44.88) v1(83.44,48.18) v1(83.57,46.91) v1(83.57,45.52) v1(85.09,31.17) v1(88.39,48.18)
VOUT-: length 67.8
  Top Layer w0.35: R42.1 56.15,3.23 v1(56.13,3.23) ; v1(59.56,18.34) 61.1,16.8 R36.1 ; v1(73.28,9.32) R14.2
  Bottom Layer w0.35: v1(56.13,3.23) 66.42,3.23 72.52,9.32 v1(73.28,9.32) ; v1(59.56,18.34) 59.56,7.42 62.48,4.5 66.42,4.5 75.27,13.35 CNT2.3
  Bottom Layer w1: CNT2.4 77.26,6.66 v1(74.29,6.66) v1(73.41,6.66) v1(72.52,6.66)
XIN: length 13.9
  Top Layer w0.3: C48.2 11.8,23.42 X2.2 14.61,22.53 14.73,22.4 15.88,22.4 17.14,21.13 17.14,18.97 17.57,18.55 U9.3
XOUT: length 13.6
  Top Layer w0.3: C50.2 11.33,20.88 X2.1 14.61,21.64 14.84,21.87 15.77,21.87 16.64,21.01 16.64,18.85 17.44,18.05 U9.4
XT2IN: length 11.5
  Top Layer w0.3: U9.5 16.99,17.55 16,16.56 14.86,16.56 14.73,16.69 14.73,17.98 X1.2 11.14,18.1 C44.2
XT2OUT: length 12
  Top Layer w0.3: U9.6 17.27,17.05 16.28,16.05 14.86,16.05 14.61,15.8 X1.1 14.59,14.02 C47.2
$1N1620: length 6.2
  Top Layer w0.5: U1.1 41.35,98.13 C1.2 45.24,96.17 45.72,96.65
$1N1981: length 6.6
  Top Layer w0.5: U1.8 38.53,90.81 39.37,89.97 R3.1
$1N2183:
  vias: v1(51.44,83.11) v1(51.74,86.45) v1(52.83,84.25) v1(52.83,83.11) v1(54.06,86.45) v1(54.13,83.11) v1(54.99,83.11) v1(55.81,86.45) v1(55.84,83.11) v1(57.02,84.25) v1(57.02,83.36) v1(58.15,86.45) v1(58.18,83.11) v1(59.06,83.11) v1(60,86.45) v1(59.97,83.11) v1(61.09,84.25) v1(65.62,84.38) v1(65.6,83.36) v1(66.56,84.38) v1(66.58,83.36) v1(67.44,83.36) v1(68.21,84.38) v1(68.25,83.36) v1(69.09,84.38) v1(69.14,83.36) v1(77.73,89.59) v1(77.73,87.43) v1(78.1,90.6) v1(78.74,87.43) v1(81.28,87.43) v1(81.66,90.6) v1(82.04,89.59) v1(82.16,87.43)
$1N5907: length 10.3
  Top Layer w0.5: D6.1 40.39,37.94 C13.2 40.04,35.97 U2.8
$1N5910: length 10.1
  Top Layer w0.5: D8.1 44.34,37.46 R15.2 43.05,34.7 U2.7
$1N5913: length 10.7
  Top Layer w0.5: U2.5 37.36,32.16 39.75,29.77 41.74,29.77 D10.1 44.34,32.37 R17.2
$1N5920: length 10.3
  Top Layer w0.5: D7.1 58.17,40.44 59.82,38.79 C14.2 59.37,35.74 U3.8
$1N5923: length 9.4
  Top Layer w0.5: D9.1 63.01,37.46 R16.2 61.48,34.47 U3.7
$1N5926: length 11.3
  Top Layer w0.5: D11.1 63.01,32.38 R18.2 63.01,30.8 61.59,29.39 57.78,29.39 56.72,30.46 U3.5
$1N7961: length 5.4
  Top Layer w0.5: Q1.1 53.8,77.84 R6.2 53.85,76.14 R5.1
$1N8016: length 9.4
  Top Layer w1: CN1.2 45.76,83.56 D2.2 Q1.3
$2N1500: length 4
  Top Layer w0.254: U4.4 38.61,72.82 37.59,73.84 37.59,75.6 R24.2
$2N1503: length 15.1
  Top Layer w0.8: D12.1 38.91,62.11 38.3,62.72 ; 38.3,62.72 L3.1 ; 38.3,62.72 38.3,63.1 35.56,65.85 35.56,66.61 ; 35.56,66.61 35.56,68.5 35.05,69.01 U4.8 ; 35.56,66.61 C17.2
$2N1504: length 3.9
  Top Layer w0.254: U4.1 37.97,69.01 37.58,68.61 C17.1
$2N1505: length 2.8
  Top Layer w0.254: C30.1 R21.1
$2N1506: length 9.3
  Top Layer w0.254: U4.6 32.26,71.55 31.88,71.17 R21.2 C28.1
$2N1507: length 32.2
  Top Layer w0.3: R25.2 29.99,48.28 R19.1 29.99,60.49 27.43,63.04 27.43,67.87 28.07,68.5 30.73,68.5 31.12,68.89 31.12,71.55 32.38,72.82 U4.5
$2N1508: length 3.9
  Top Layer w0.254: LED3.2 37.92,46.37 R20.1
$2N2108: length 4.8
  Top Layer w0.5: U5.6 31.75,89.71 32.64,90.6 34.37,90.6 C29.2
$2N2110: length 9.2
  Top Layer w0.254: C20.2 27.42,85.14 28.45,85.14 30.48,83.11 U5.2
  Top Layer w1: L4.1 30.48,80.14 U5.2
$2N2115: length 7.4
  Top Layer w0.35: C23.1 R23.1 35.18,87.41 ; 35.18,87.41 R26.2 ; 35.18,87.41 34.68,87.91 U5.5
$2N2117: length 4.4
  Top Layer w0.35: C31.2 33.02,81.22 U5.4
$2N2130: length 4.3
  Top Layer w0.254: U5.1 29.21,83.74 28.81,84.14 C20.1
$2N3829: length 2.6
  Top Layer w0.3: R27.2 18.67,67.84 LED2.2
$3N1892: length 6.5
  Top Layer w0.35: U12.3 56.49,22.01 R28.1 R30.2
$3N1896: length 6.4
  Top Layer w0.35: R32.2 R37.2 56.04,23.28 U12.2
$3N1897: length 64.1
  Top Layer w0.3: R37.1 56.15,27.74 v1(57.02,27.74)
  Top Layer w0.35: R37.1 56.77,24.55 U12.1 ; R33.2 v1(15.22,8.31)
  Inner2 w0.3: v1(15.22,8.31) 48.51,8.31 50.29,10.08 50.29,21.01 v1(57.02,27.74)
  Bottom Layer w0.35: v1(15.22,8.31) 15.24,8.31
$3N1903: length 6.4
  Top Layer w0.35: U12.5 66.07,20.74 R39.1 R41.2
$3N1906: length 7.2
  Top Layer w0.35: R43.2 R47.2 63.98,22.01 U12.6
$3N1907: length 66
  Top Layer w0.35: R47.1 64.9,24.93 64.9,24.18 63.99,23.28 U12.7 v1(61.47,23.28) ; v1(17.14,7.67) 16.26,6.78 R44.2
  Inner2 w0.3: v1(17.14,7.67) 20.95,7.67 22.48,6.15 34.93,6.15 36.19,7.42 49.15,7.42 51.44,9.7 51.44,18.21 55.63,22.4 60.59,22.4 v1(61.47,23.28)
$3N1910: length 10.9
  Top Layer w0.35: R31.2 61.47,14.13 U13.3 61.47,11.61 59.45,9.59 R29.1
$3N1914: length 5.3
  Top Layer w0.35: U13.2 62.74,16.2 R36.2 R38.2
$3N1915: length 60.3
  Top Layer w0.35: v1(63.25,11.35) 64.01,12.12 U13.1 64.03,13.51 65.66,13.51 67.17,15.02 R38.1 ; R35.2 v1(16.64,3.73)
  Inner2 w0.35: v1(16.64,3.73) 17.27,3.1 54.23,3.1 60.2,9.07 62.36,9.07 63.25,9.96 v1(63.25,11.35)
$3N1921: length 6.4
  Top Layer w0.35: U13.5 60.2,5.53 R40.1 R42.2
$3N1923: length 6.5
  Top Layer w0.35: U13.6 61.47,5.91 R48.2 R46.2
$3N1924: length 47.7
  Top Layer w0.35: R45.2 v1(24.62,5.26) ; v1(62.1,10.47) 62.74,9.83 U13.7 62.74,6.64 R48.1
  Inner2 w0.35: v1(62.1,10.47) 53.47,10.47 48.26,5.26 v1(24.62,5.26)
$3N2124: length 6.1
  Top Layer w0.35: R31.1 55.16,16.56 ; 55.16,16.56 R34.2 ; 55.16,16.56 55.16,14.56 TP14.1
$4N3840: length 8
  Top Layer w0.5: BUZZER.2 46.7,17.09 Q6.3
$4N3848: length 5.4
  Top Layer w0.5: 43.2,19.54 45.07,21.42 R51.1 R52.2
$4N4666: length 2.6
  Top Layer w0.35: C59.2 11.27,91.98 U11.4

## Copper pours and planes (outline as drawn; the poured copper is in the pictures)
GND on Top Layer: 45.84,61.27 45.39,61.72 45.39,63.58 44.66,64.31 41.91,64.31 41.4,64.82 41.4,69.39 42.29,70.28 44.7,70.28 46.61,72.19 55.15,72.19 58.67,75.71 58.67,76.42 59.6,77.34 63.93,77.34 64.9,76.38 64.9,72.69 61.59,69.39 52.01,69.39 51.31,68.69 51.31,62.81 49.76,61.27
GND on Top Layer: 80.52,81.33 81.28,82.09 82.55,82.09 86.74,86.28 92.33,86.28 93.6,85.01 93.6,78.66 99.06,73.2 99.06,26.97 93.73,21.64 93.73,18.34 99.06,13 99.06,3.86 96.01,0.81 69.09,0.81 67.56,2.34 67.56,14.78 71.63,18.85 71.63,41.58 72.9,42.85 76.33,42.85 78.99,40.18 78.99,32.06 79.12,31.93 79.12,30.53 78.99,30.4 78.99,29.77 76.2,26.97 76.2,14.4 75.06,13.26 71.37,13.26 70.61,12.5 70.61,6.02 71.25,5.38 88.26,5.38 89.41,6.53 89.41,14.66 89.03,15.04 89.03,27.61 88.26,28.37 88.26,39.67 92.46,43.87 92.46,49.45 90.81,51.11 81.53,51.11 80.52,52.12 80.52,58.09 79.5,59.11 67.69,59.11 67.18,59.61 67.18,62.79 67.56,63.17 79.38,63.17 80.52,64.31
GND on Bottom Layer: 0.76,97.21 2.92,99.37 47.75,99.37 49.28,97.84 49.28,83.62 50.93,81.97 62.99,81.97 63.75,81.2 63.75,77.72 64.9,76.57 64.9,72.95 61.47,69.52 52.07,69.52 51.18,68.63 51.18,62.92 47.62,59.36 47.62,46.03 48.51,45.14 56.01,45.14 56.64,44.5 70.74,44.5 71.25,43.99 71.25,19.1 67.06,14.92 67.06,1.2 66.42,0.56 2.79,0.56 0.76,2.59 0.76,15.8 1.91,16.94 4.55,16.94 6.57,18.97 6.57,21.16 4.57,23.16 1.65,23.16 0.76,24.05 0.76,75.74 2.03,77.01 4.57,77.01 6.35,78.79 6.35,81.46 4.8,83.01 2,83.01 0.76,84.25
GND on Bottom Layer: 85.34,89.2 85.34,84.89 82.42,81.97 81.28,81.97 80.65,81.33 80.65,64.31 79.38,63.04 62.23,63.04 61.85,62.66 61.85,59.74 62.36,59.23 79.48,59.23 80.49,58.23 80.49,52.15 81.53,51.11 90.81,51.11 92.46,49.45 92.46,43.74 87.76,39.04 87.76,29.14 89.66,27.24 89.66,19.61 88.26,18.21 77.34,18.21 76.07,19.48 76.07,27.22 79.12,30.27 79.12,40.18 76.45,42.85 73.03,42.85 71.63,41.45 71.63,18.59 67.69,14.66 67.69,2.06 69.07,0.68 95.88,0.68 99.06,3.86 99.06,12.62 93.6,18.09 93.6,21.64 98.93,26.97 98.93,73.2 93.47,78.66 93.47,81.97 95.38,83.87 97.79,83.87 99.31,85.39 99.31,89.71 98.68,90.35 86.49,90.35
GND on GND层: 0.38,99.62 99.62,99.62 99.62,0.38 0.38,0.38
VBUS on Top Layer: 57.4,92 59.05,92 61.21,89.84 61.21,89.08 59.94,87.81 45.97,87.81 44.83,88.95 44.83,94.28 44.96,94.41 47.75,94.41 50.16,92 57.4,92
VIN+ on Top Layer: 79.41,81.97 80.14,81.33 80.14,64.57 79.12,63.55 62.1,63.55 61.85,63.81 61.85,68.89 65.41,72.44 65.41,76.67 64.09,77.99 60.58,77.99 60.07,78.5 60.07,81.21 60.83,81.97
VIN+ on Bottom Layer: 61.98,68.89 61.98,64 62.3,63.67 78.82,63.67 79.97,64.82 79.97,81.25 79.38,81.84 64.9,81.84 64.26,81.2 64.26,78.03 65.41,76.89 65.41,72.31
VIN- on Top Layer: 85.36,90.86 82.65,92.03 77.45,92.03 75.55,90.16 61.53,90.16 58.55,93.14 50.62,93.14 49.32,94.44 49.32,99.16 49.66,99.49 96.65,99.49 99.31,96.83 99.31,91.62 98.55,90.86
VIN- on Bottom Layer: 50.74,99.37 50.09,98.62 50.09,93.7 50.55,93.24 58.7,93.24 61.72,90.22 75.56,90.22 77.47,92.13 82.55,92.13 84.46,90.22 85.34,90.22 85.98,90.86 98.46,90.86 99.25,91.64 99.25,96.89 96.77,99.37
HS-1 on Top Layer: 51.69,68.5 52.2,69.01 60.58,69.01 61.47,68.12 61.47,55.33 55.12,48.98 55.12,46.03 54.71,45.62 48.41,45.62 48.13,45.89 48.13,59.11 51.69,62.66
HS-1 on Bottom Layer: 51.82,62.66 51.82,68.5 52.16,68.85 60.55,68.85 61.21,68.18 61.21,55.3 51.56,45.64 48.77,45.64 48.17,46.25 48.17,59.02
HS-2 on Top Layer: 80.14,57.96 79.38,58.72 62.38,58.72 61.9,58.25 61.9,54.97 55.64,48.7 55.64,46.01 55.88,45.77 76.33,45.77 76.58,46.03 76.58,49.07 80.14,52.63
HS-2 on Bottom Layer: 55.75,48.69 65.66,58.6 79.38,58.6 80.01,57.96 80.01,52.76 76.33,49.07 76.33,46.79 74.55,45.01 57.02,45.01 55.75,46.27
VOUT+ on Top Layer: 77.2,42.98 77.2,48.93 78.99,50.72 90.55,50.72 92.07,49.2 92.07,44.05 87.76,39.73 87.76,28.12 88.65,27.23 88.65,19.99 87.76,19.1 77.6,19.1 76.71,19.99 76.71,26.85 79.63,29.77 79.63,40.55
VOUT+ on Bottom Layer: 77.34,42.98 77.34,49.07 78.87,50.6 90.68,50.6 91.95,49.33 91.95,44.63 87,39.67 87,29.13 89.03,27.1 89.03,19.86 88.01,18.85 77.72,18.85 76.45,20.12 76.45,26.97 79.63,30.15 79.63,40.69
VOUT- on Top Layer: 70.99,6.4 70.99,8.43 71.25,8.69 74.8,8.69 76.33,10.21 76.33,13.89 77.6,15.16 88.14,15.16 88.9,14.4 88.9,6.91 87.88,5.89 71.5,5.89
$1N2183 on Top Layer: 49.02,86.92 49.45,87.34 60.02,87.34 62.39,89.71 75.82,89.71 77.72,91.62 82.42,91.62 84.96,89.08 84.96,84.89 82.68,82.6 49.53,82.6 49.02,83.11
$1N2183 on Bottom Layer: 51.3,87.22 50.54,86.45 50.54,83.11 51.05,82.6 82.55,82.6 84.84,84.89 84.84,88.95 82.42,91.36 77.72,91.36 75.95,89.59 62.48,89.59 60.07,87.17

Small or netless copper shapes (teardrops, artwork), in the pictures only: 753 on Top Layer, 31 on Bottom Layer, 34 on GND层, 85 on Inner2

## Text on the board
Bottom Silkscreen Layer: blog.zeruns.tech
Top Silkscreen Layer: T1CH1 | T1CH2 | SCL3 | SDA3 | RESET | BOOT0 | 3V3 | CLK | GND | DIO | PC2 | PA6 | TX2 | PA7 | RX2 | PC4 | PC5 | 5V | - | +
